# EasyEDA schematic SCH_AidF-Car-Radio.json

## Sheets
1 Power Inlet: TITLE: AidF Radio Power and Connectors; REV: 1.0; Date: 2024-07-25; Sheet: 1/10; Drawn By: Aidan C Franits; Company: AidF Electronics
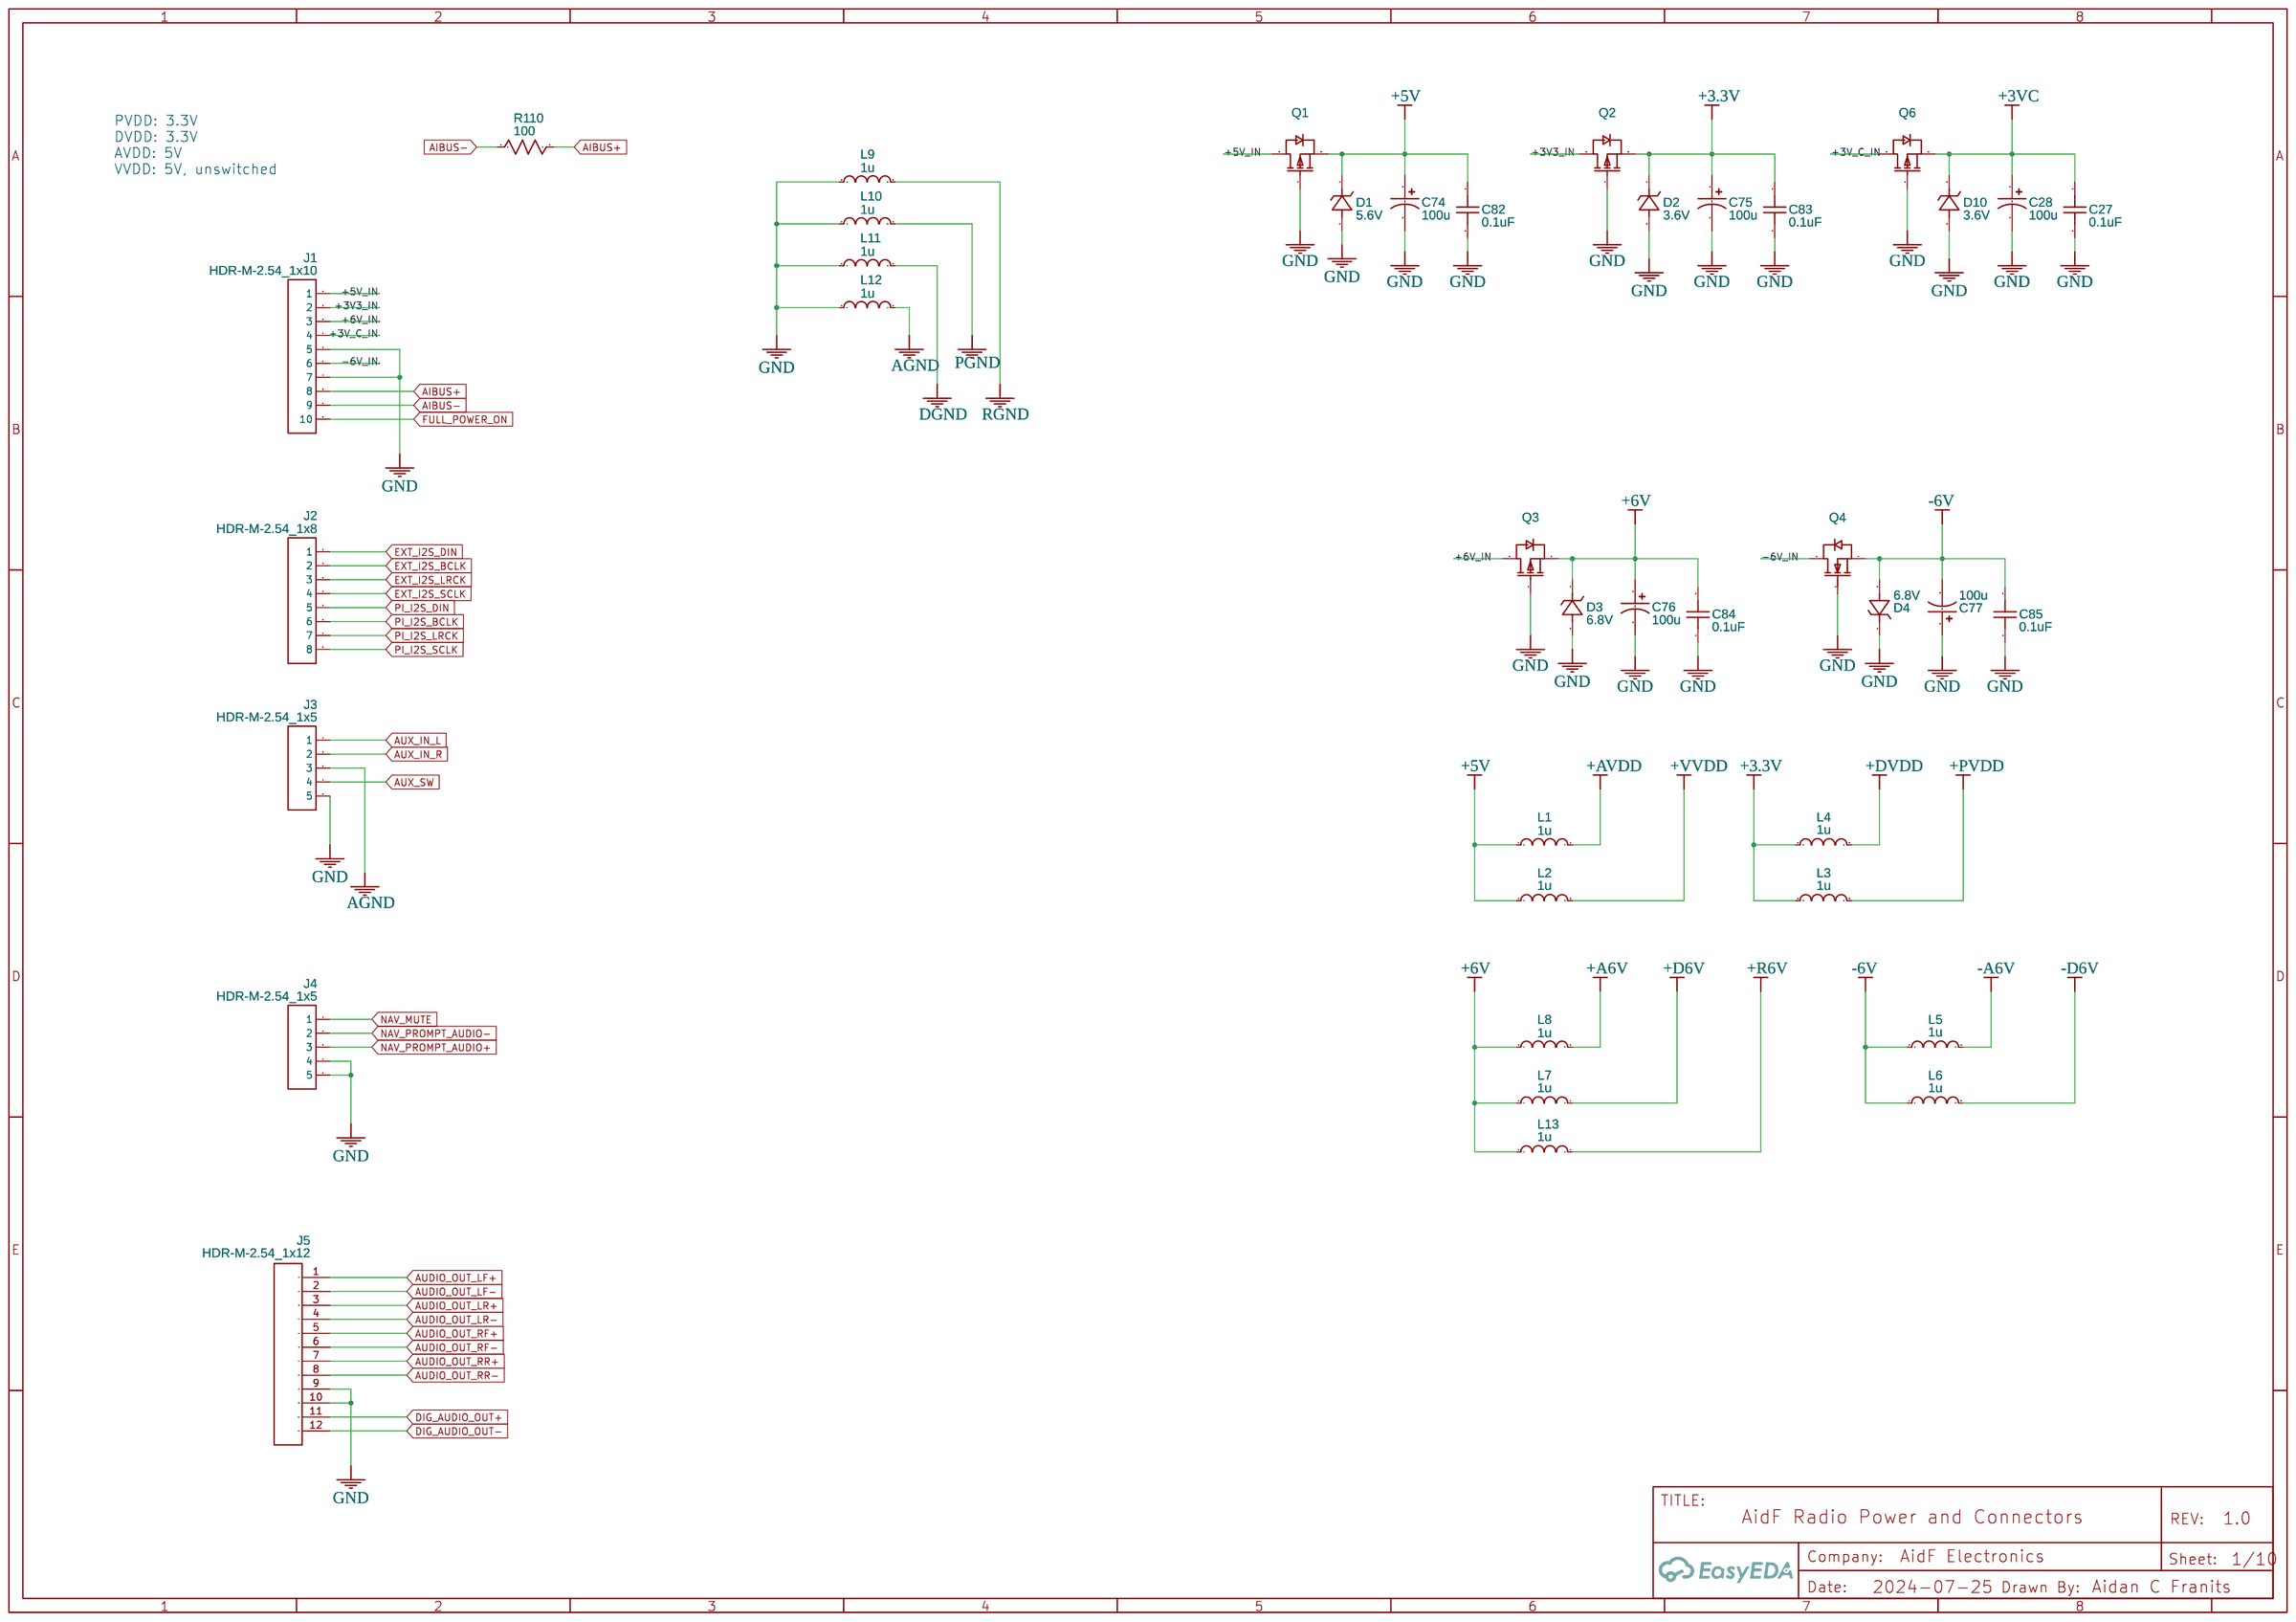
[diagram p0: Power Inlet]
2 Main Controller: TITLE: AidF Radio Main Controller; Sheet: 2/10
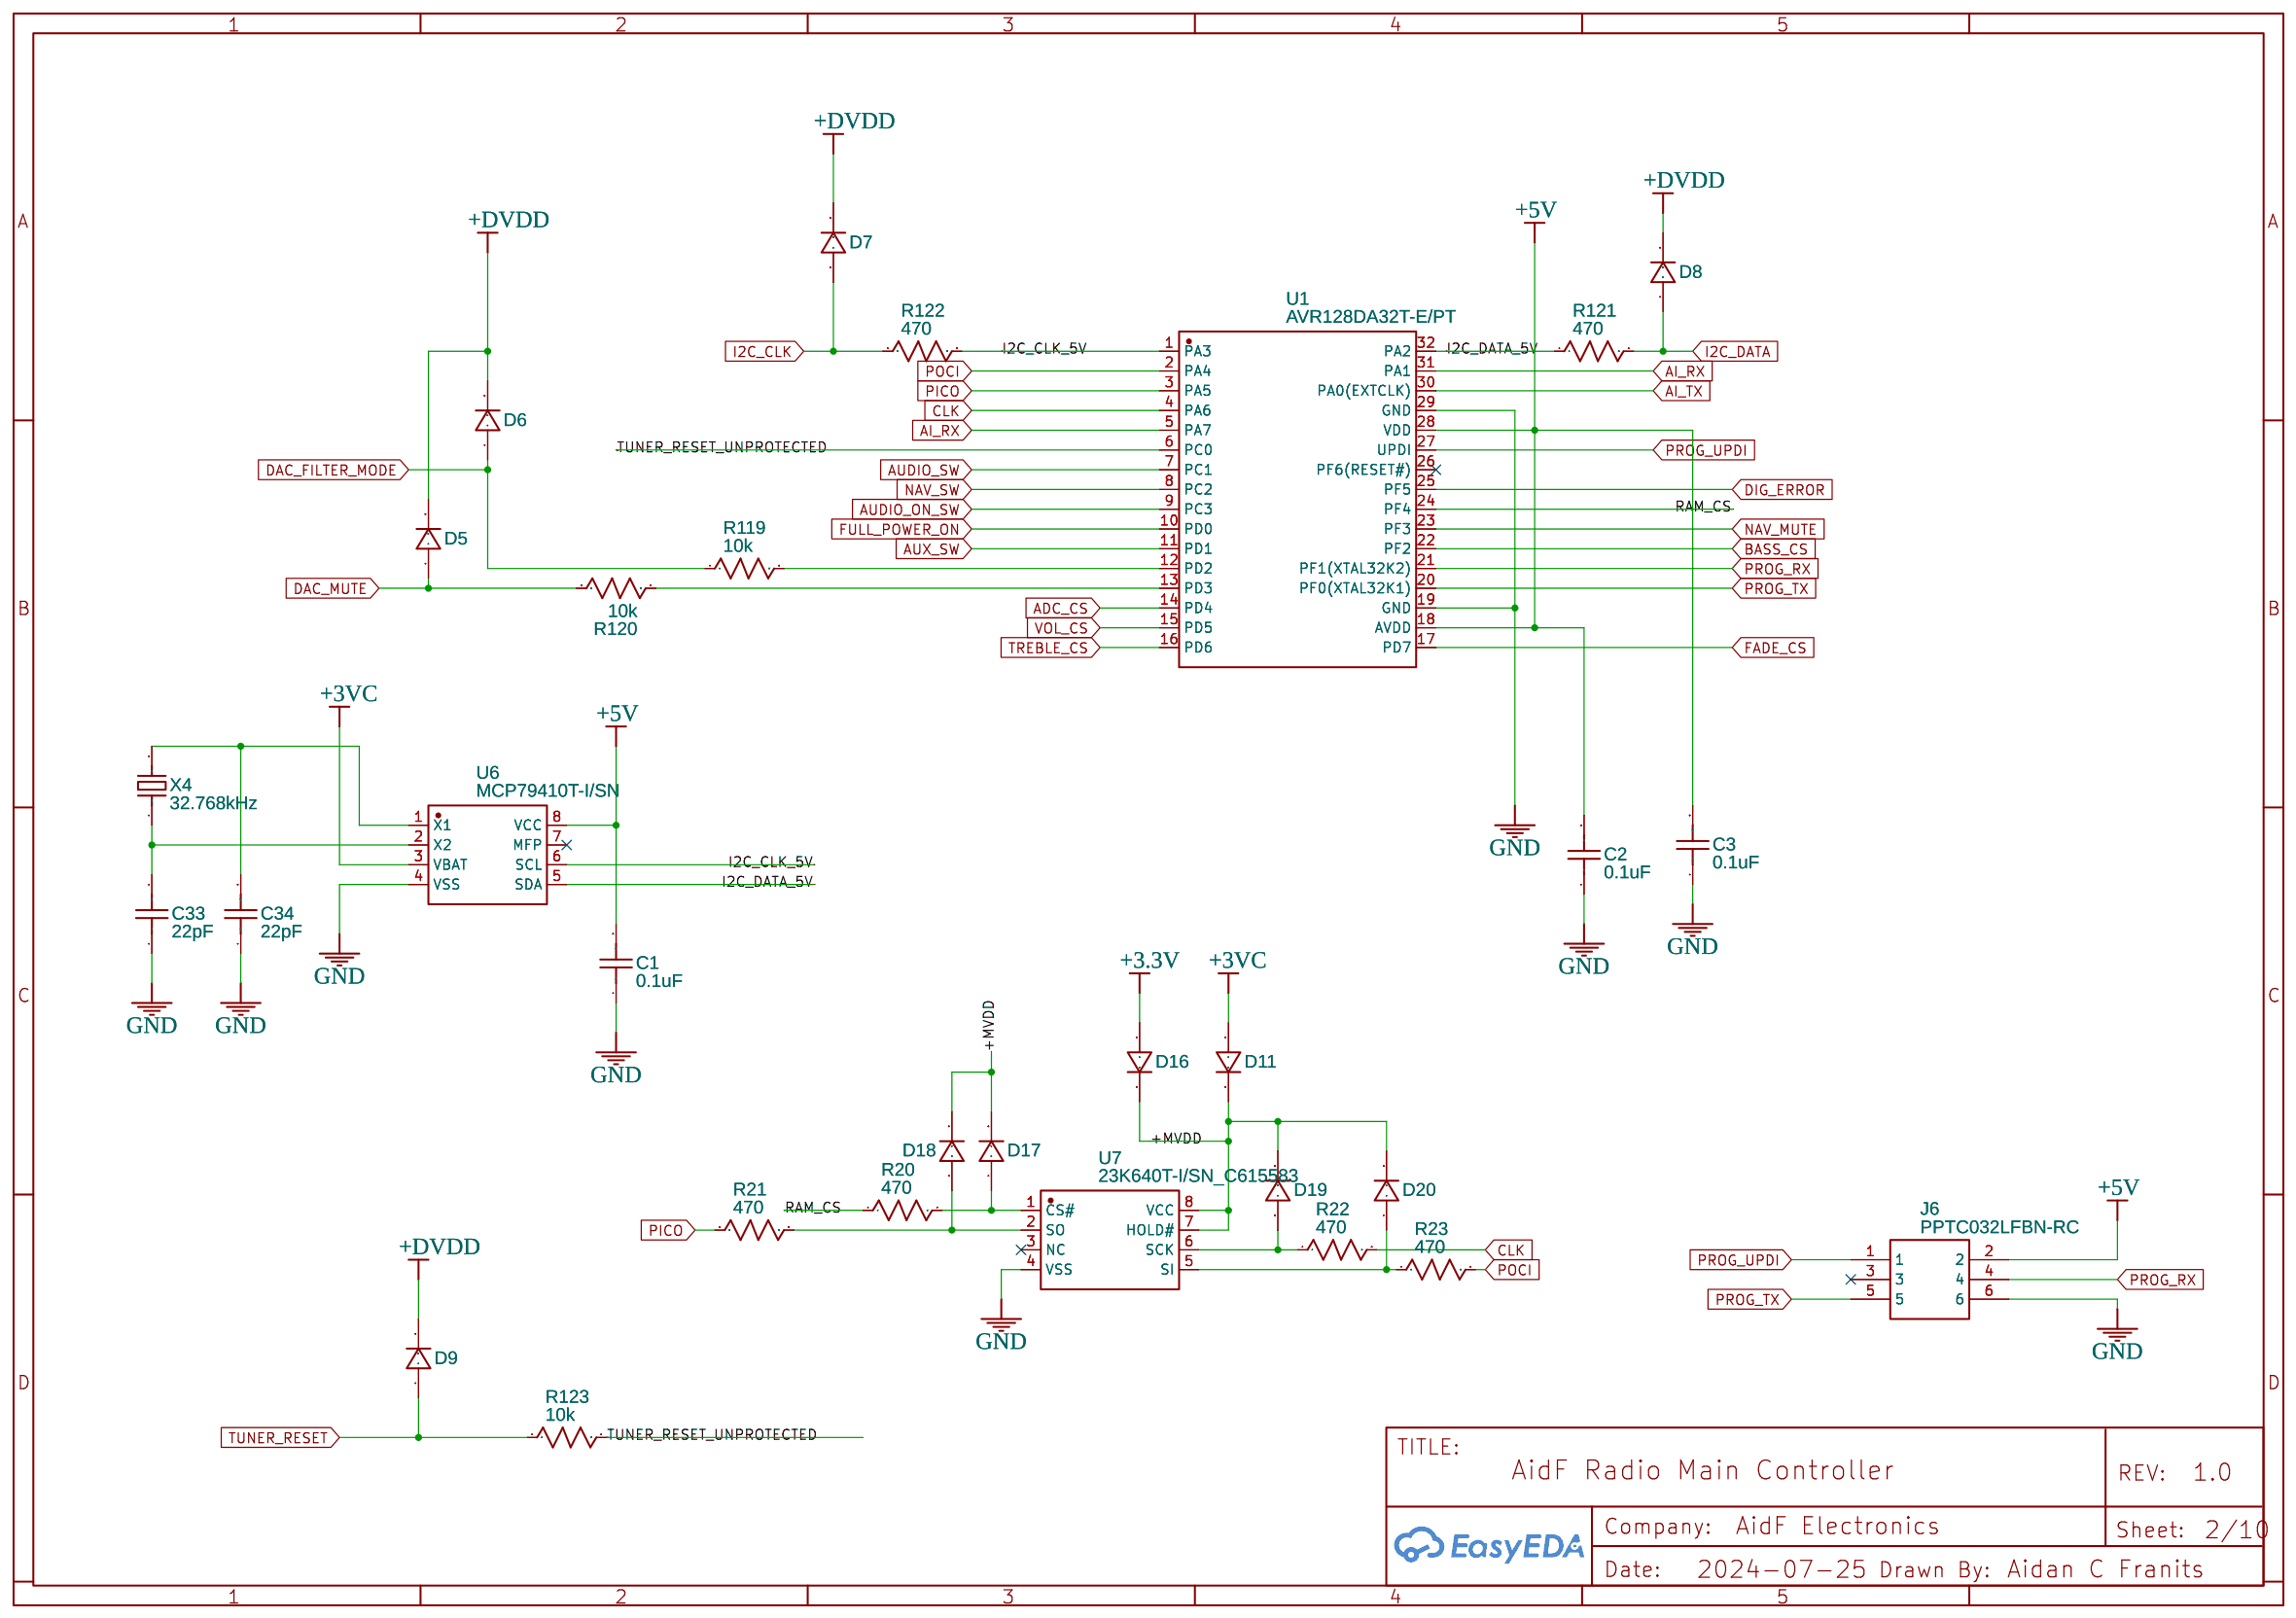
[diagram p1: Main Controller]
3 AIBus Inlet: TITLE: AidF Radio AIBus Transceiver; Date: 2024-09-01; Sheet: 3/10
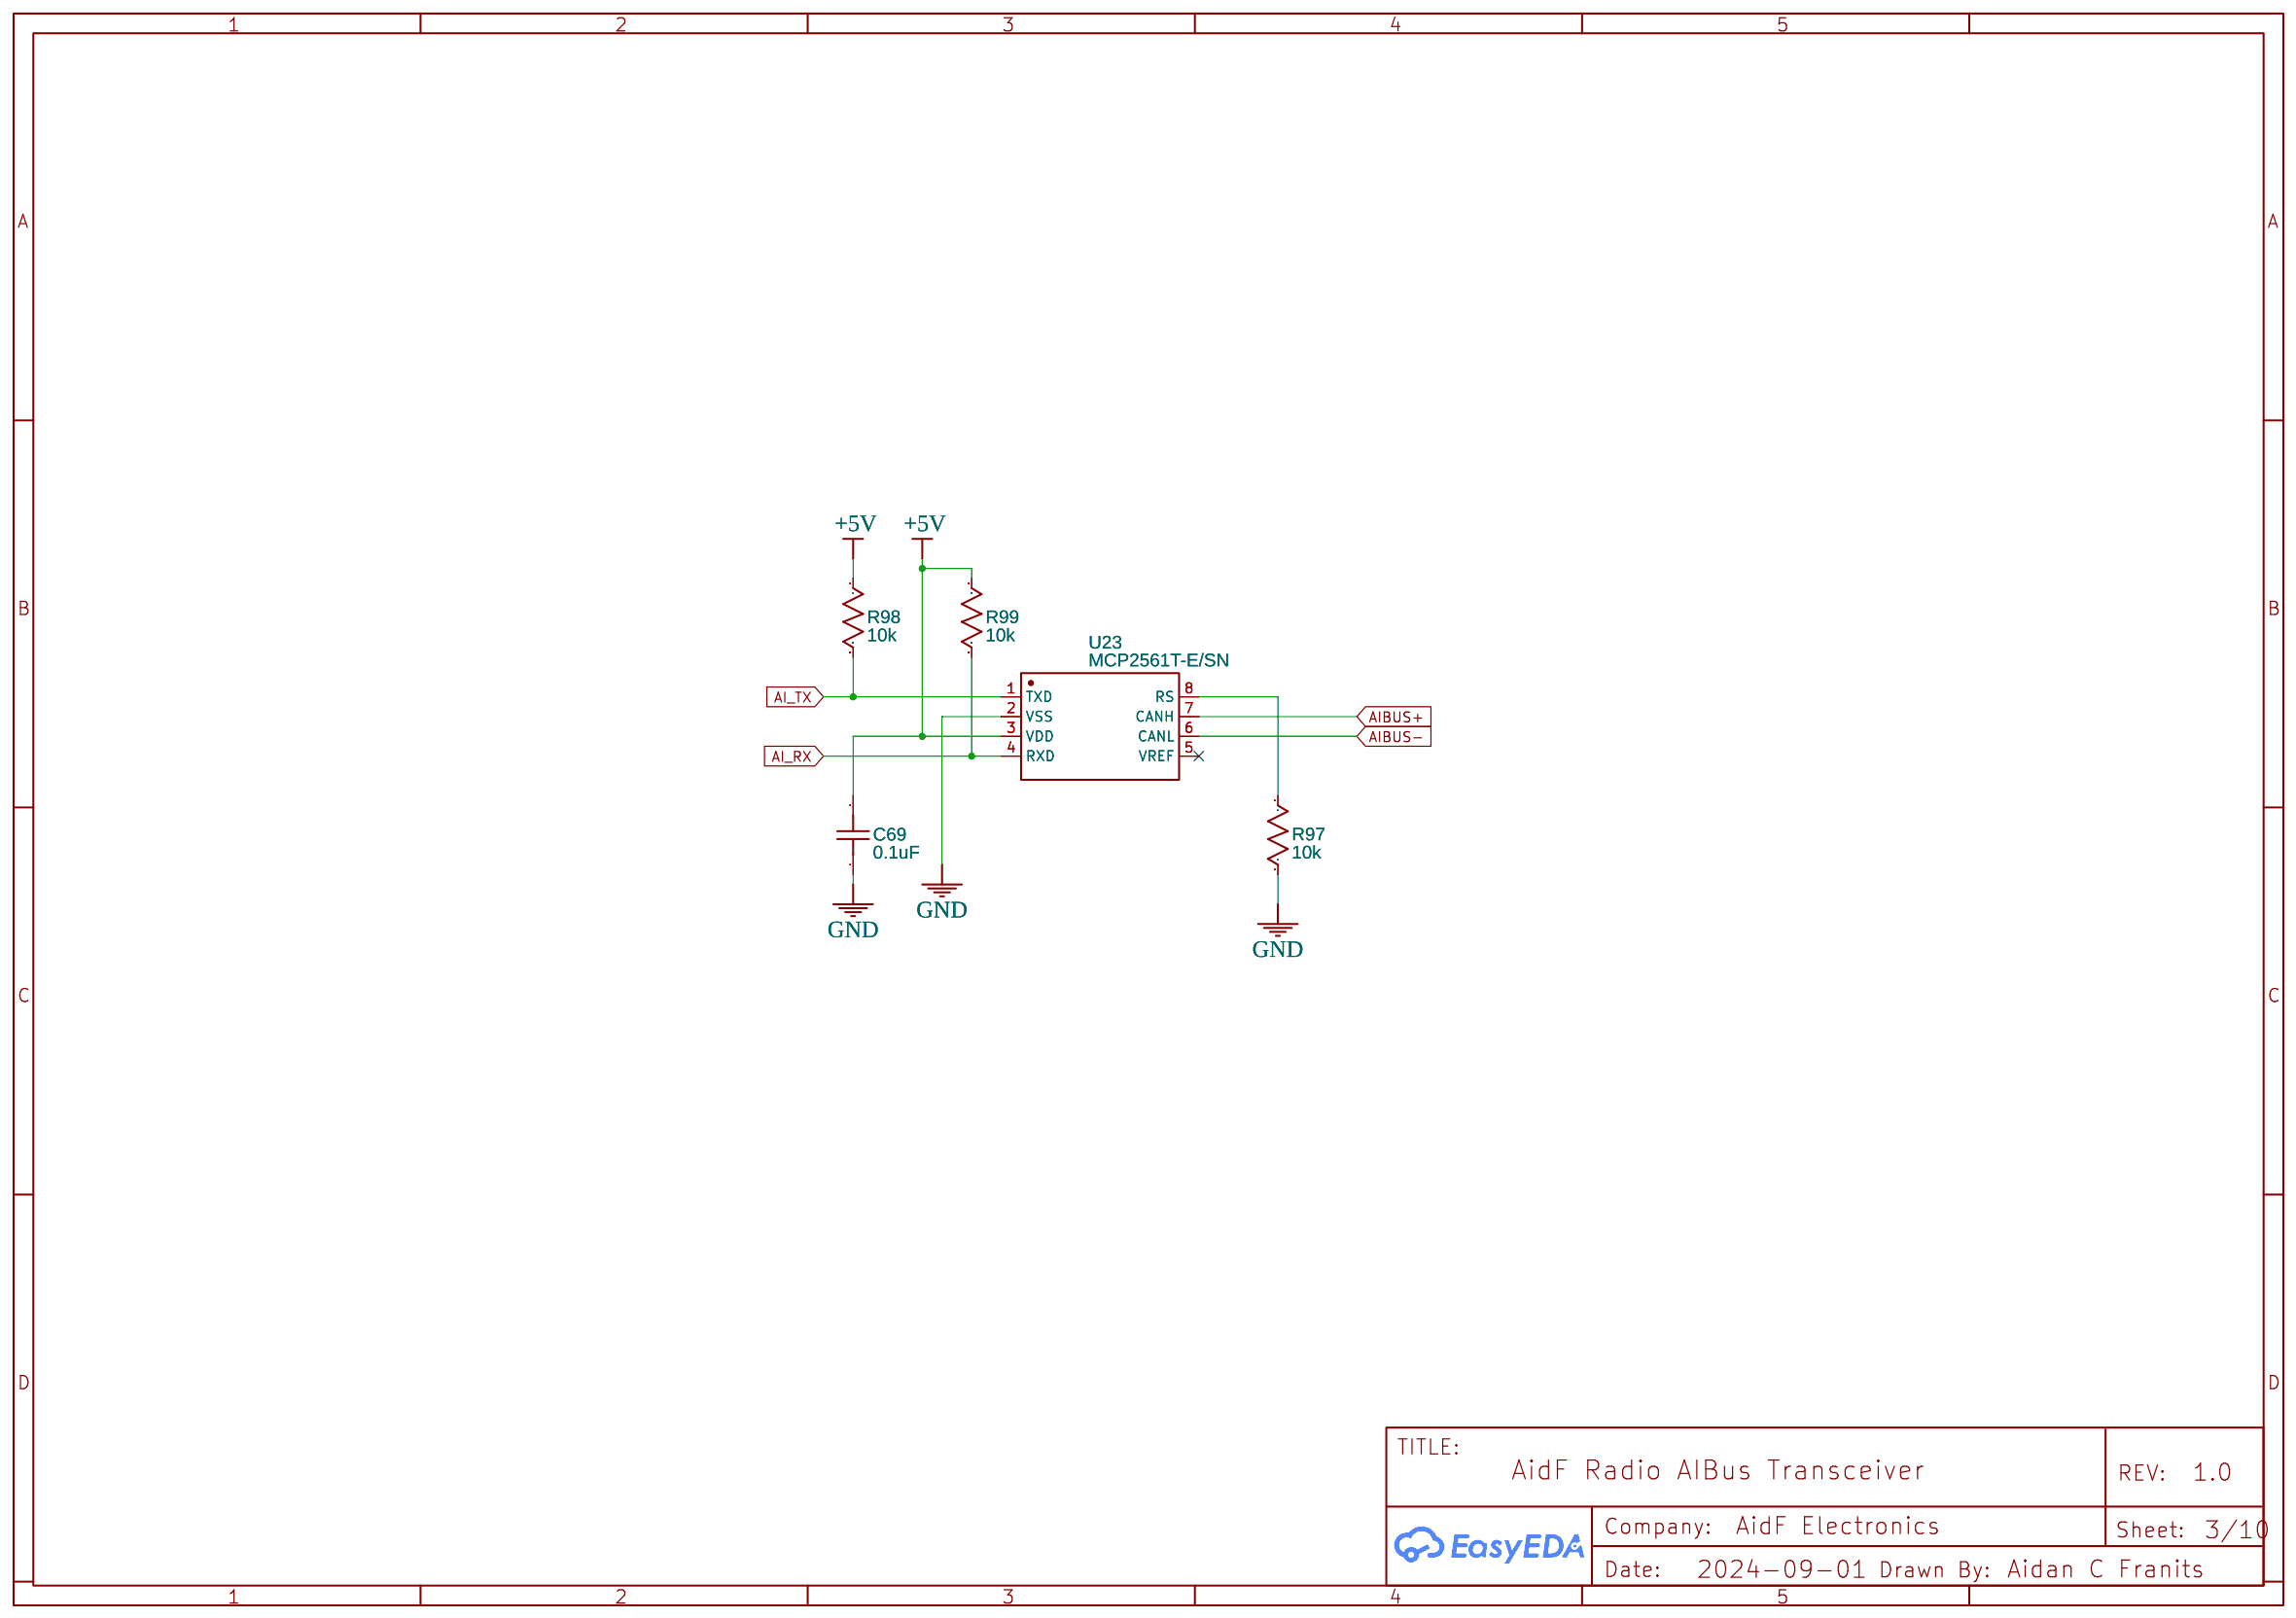
[diagram p2: AIBus Inlet]
4 Antenna Amplifier: TITLE: AidF Radio Antenna Amplifier; Date: 2024-09-04; Sheet: 4/10
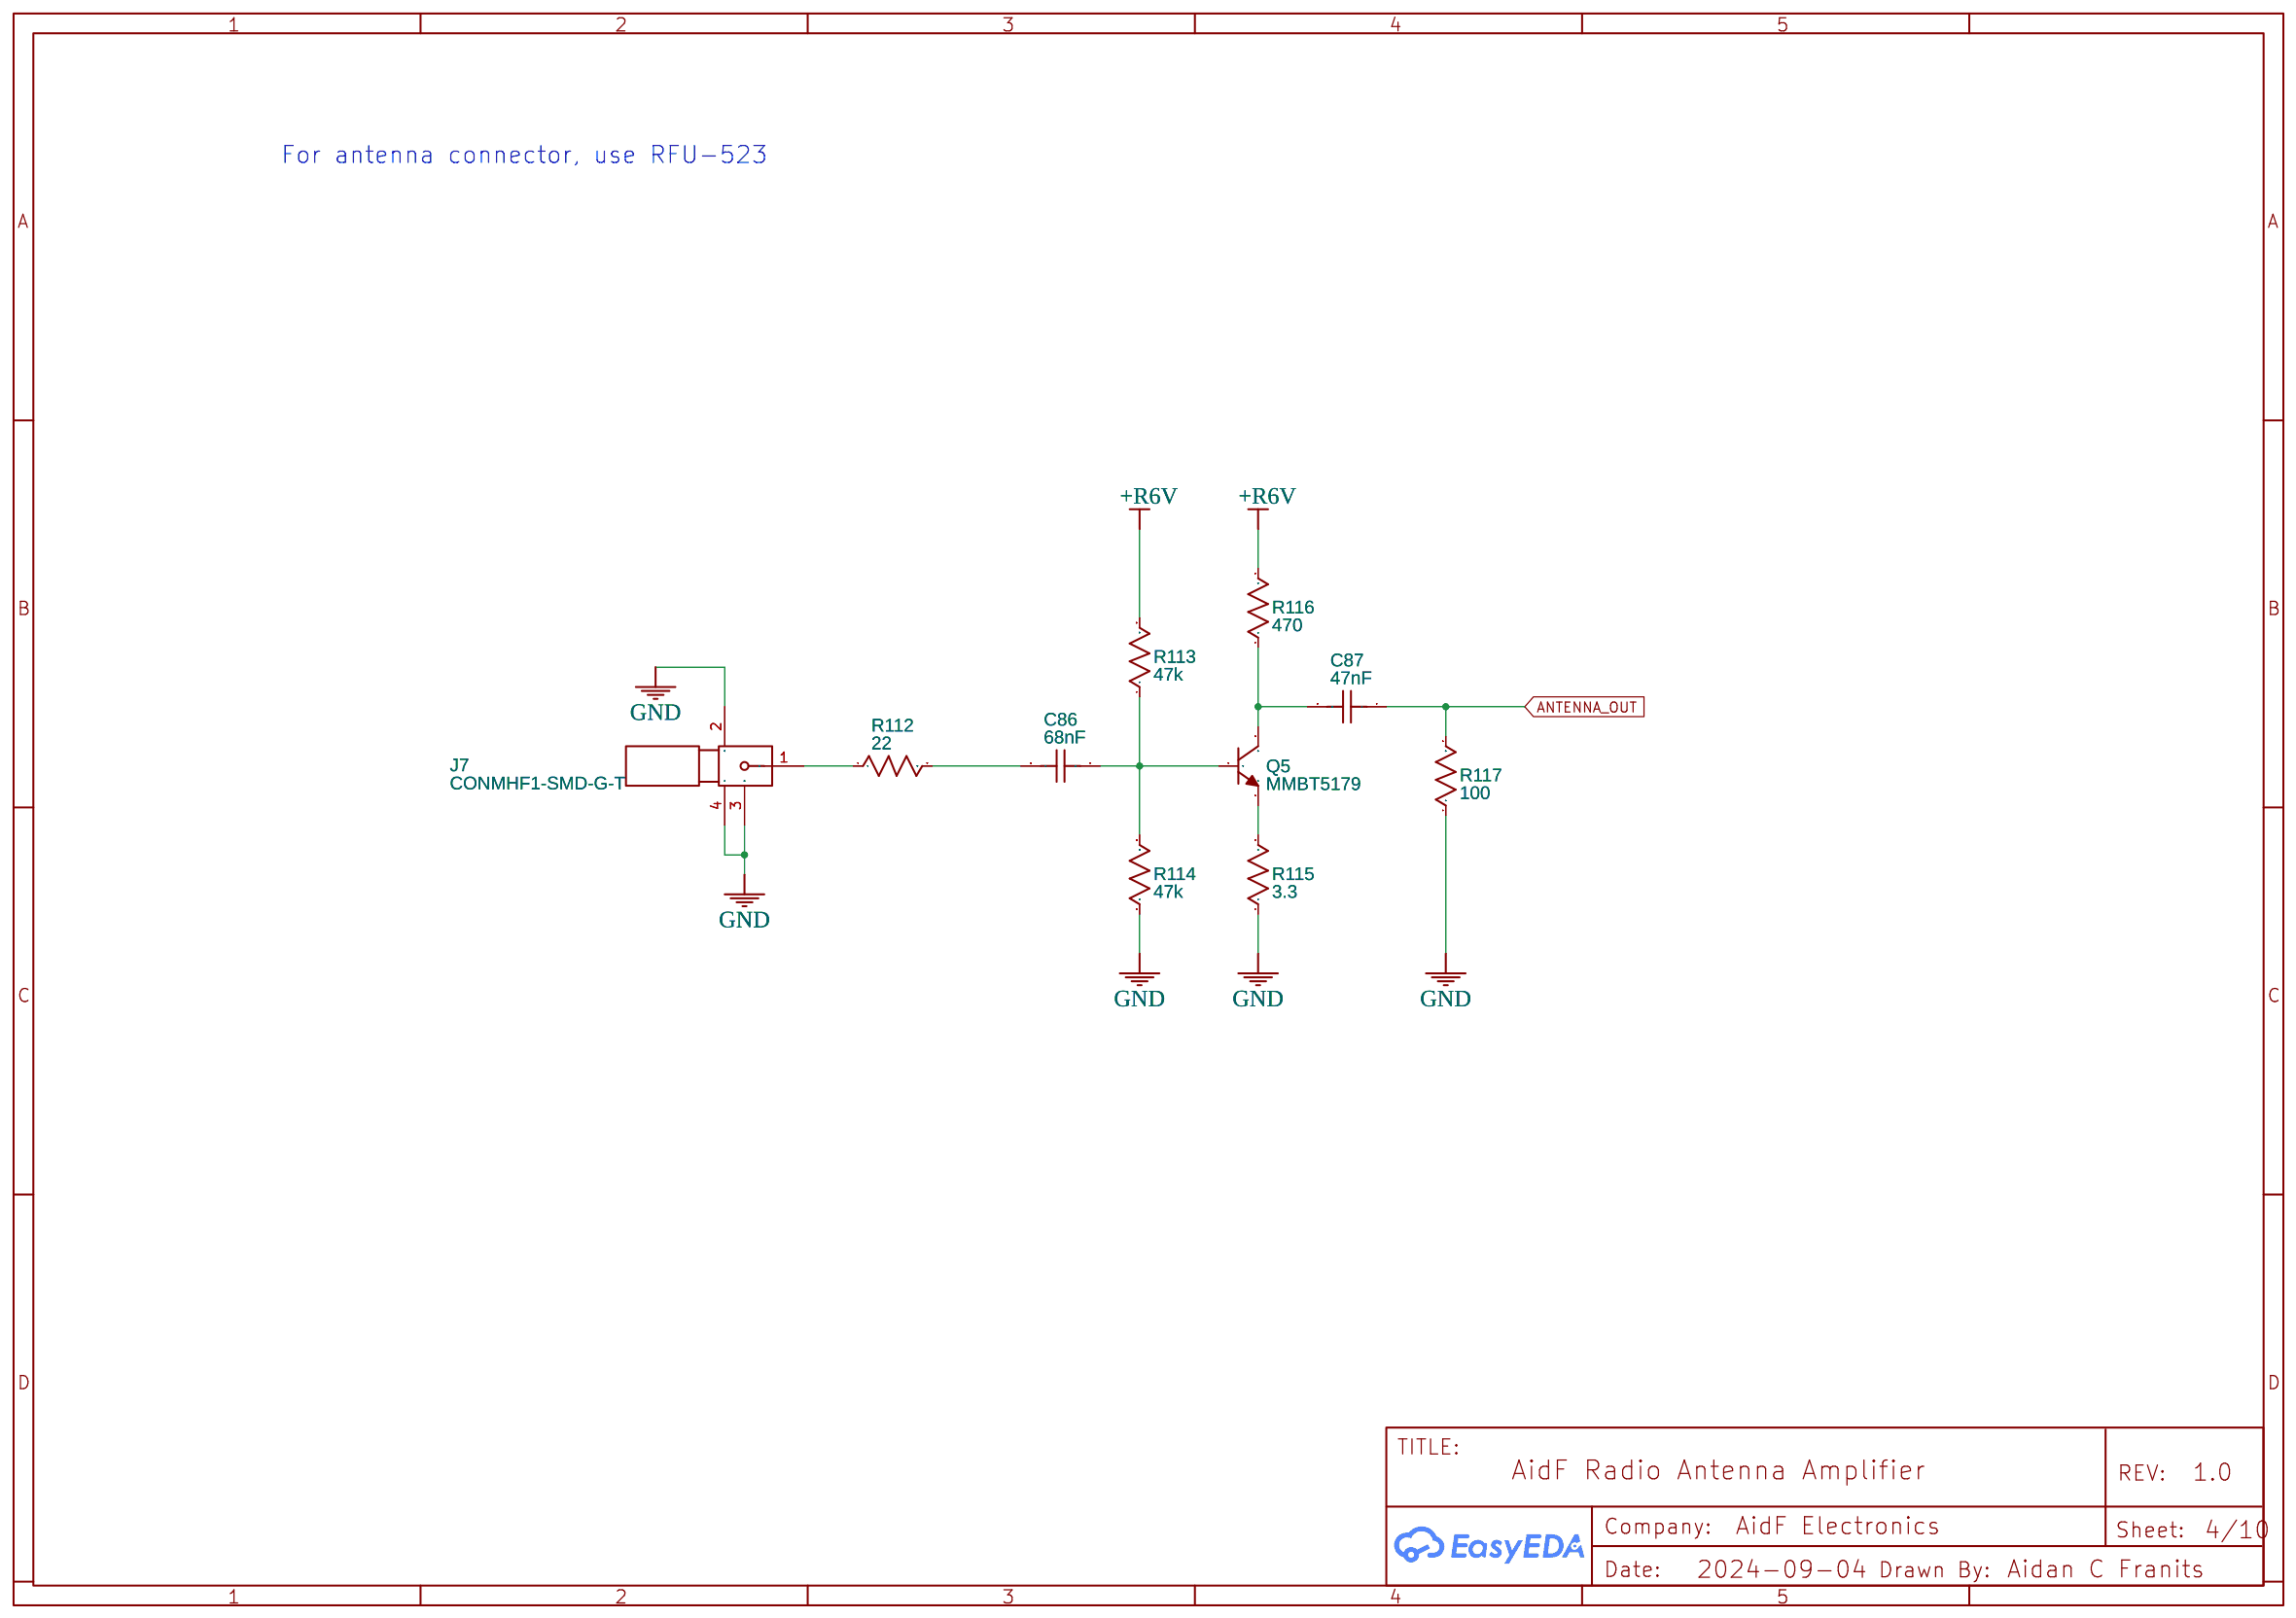
[diagram p3: Antenna Amplifier]
5 Tuner Array: TITLE: AidF Radio Tuner; Date: 2024-07-27; Sheet: 5/10
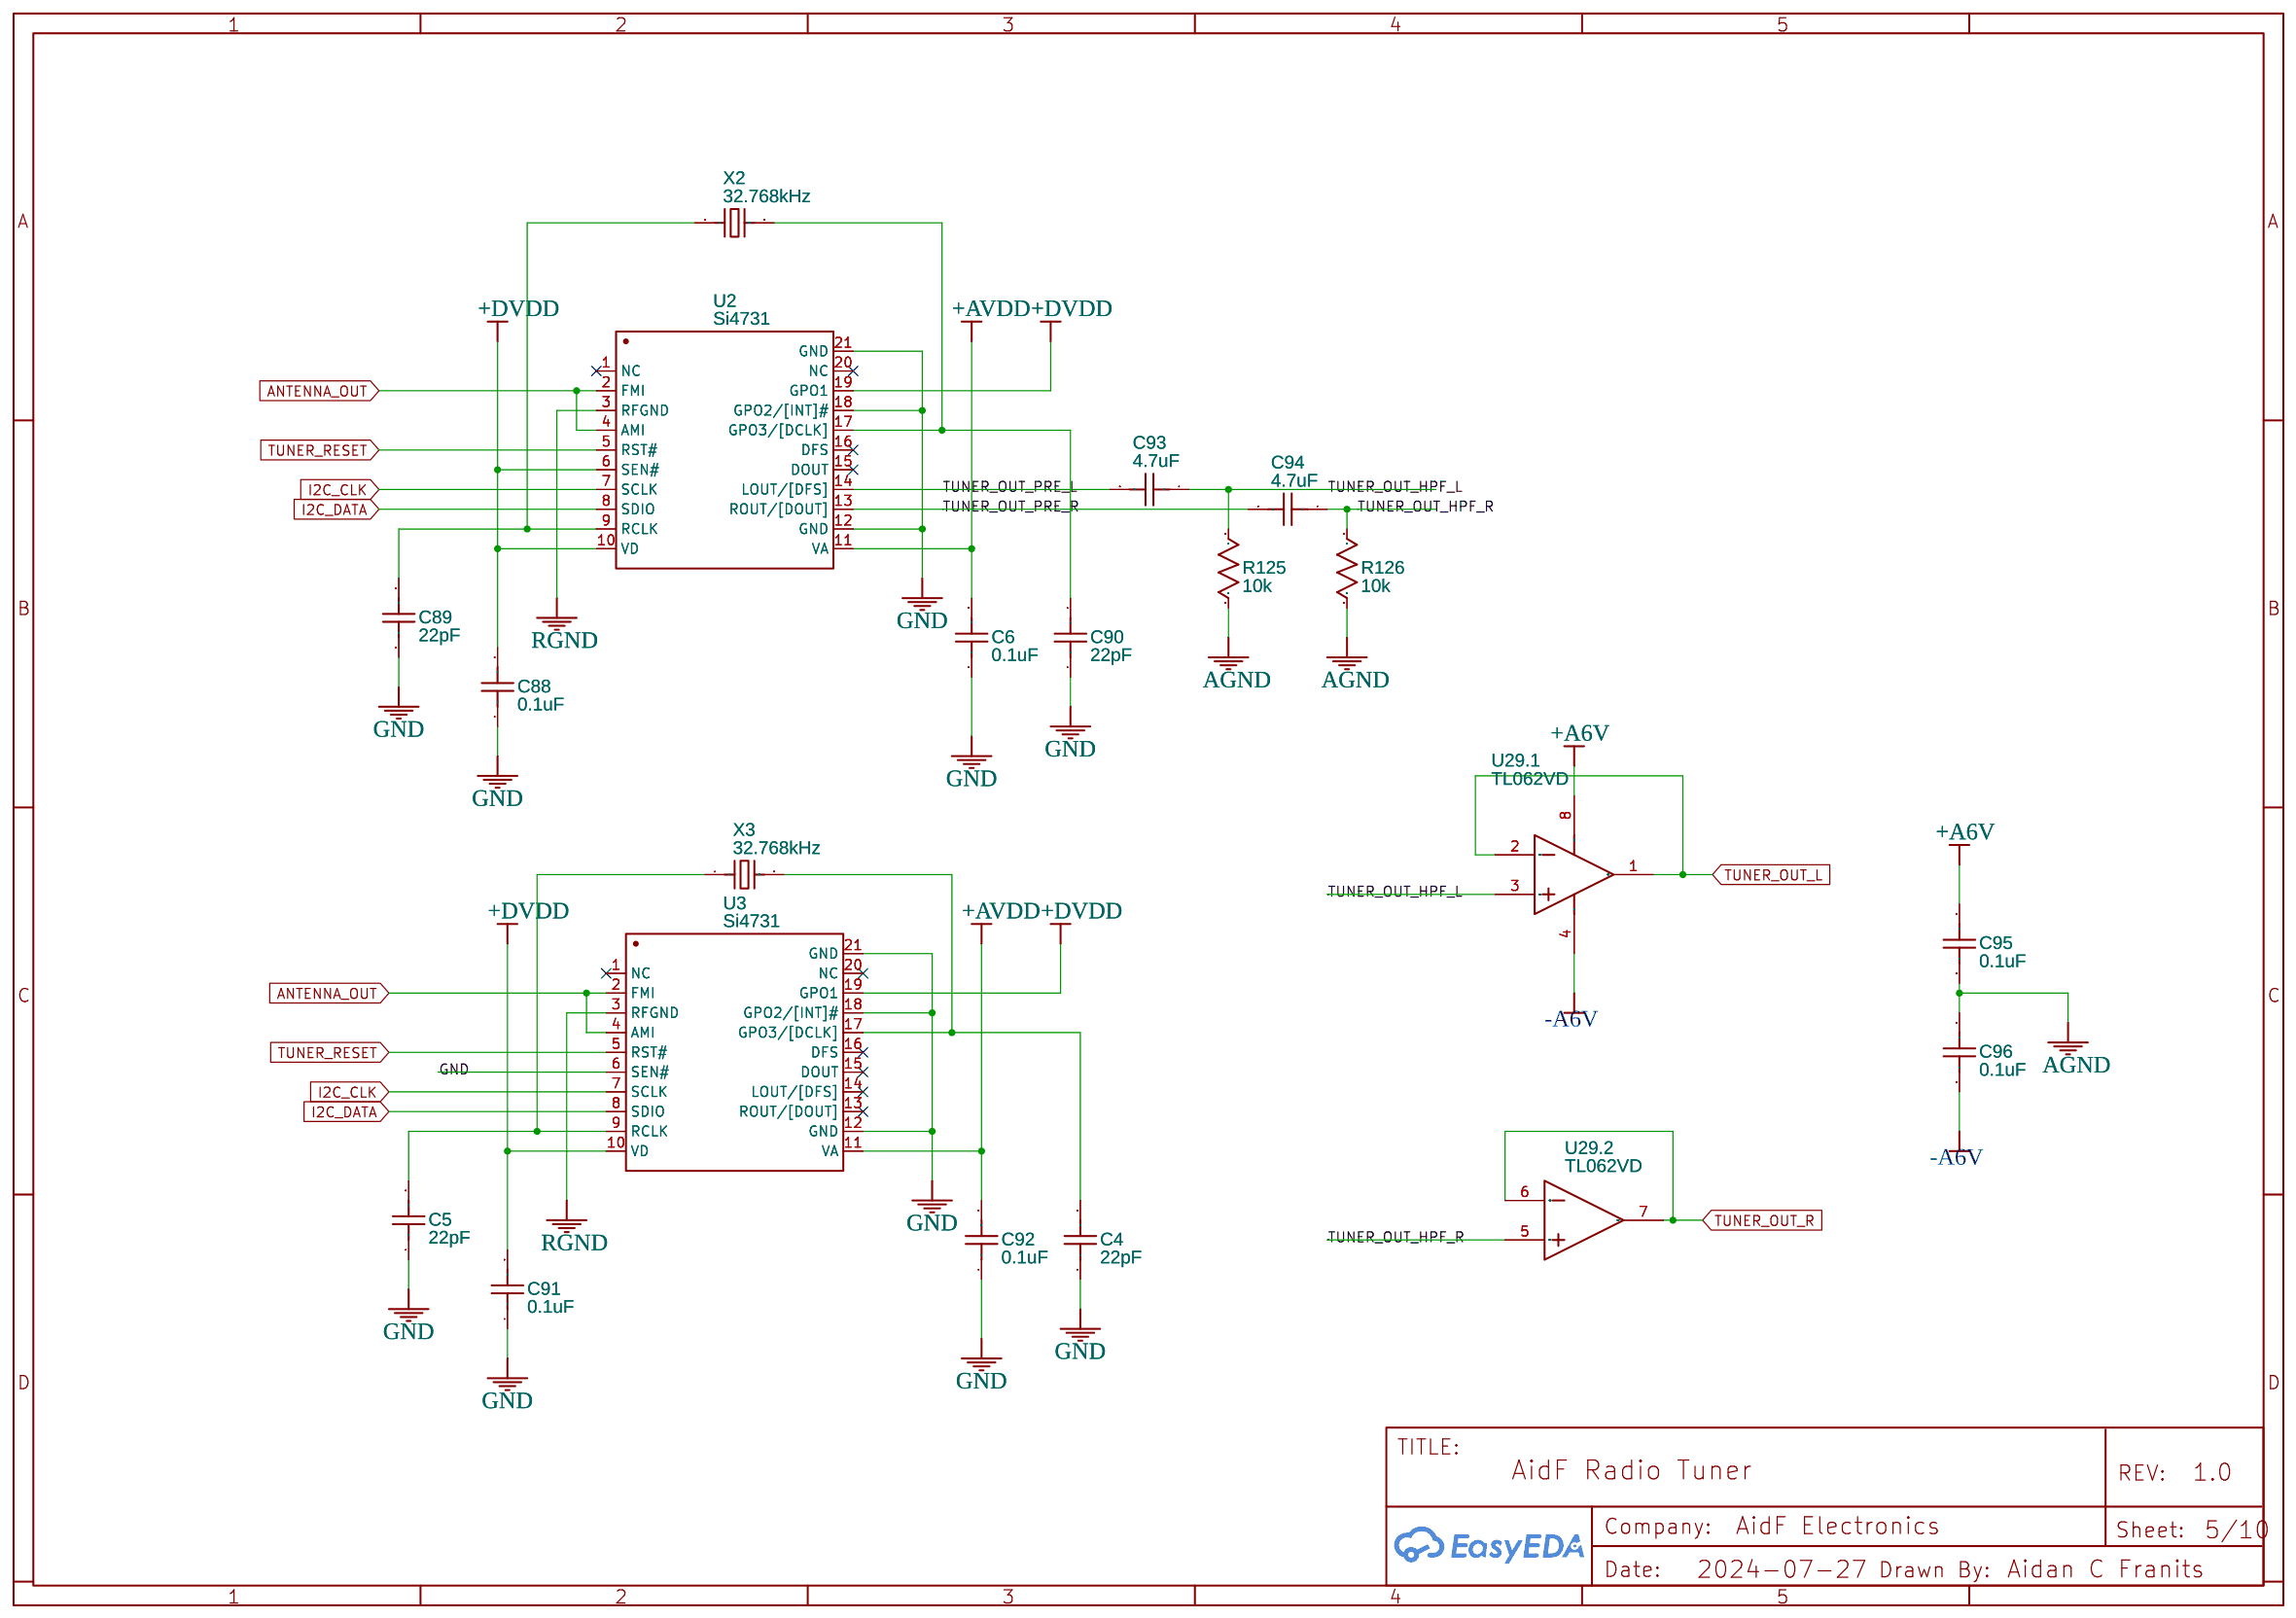
[diagram p4: Tuner Array]
6 Input De-Balancers: TITLE: AidF Radio Input Unbalancer; Date: 2024-09-01; Sheet: 6/10
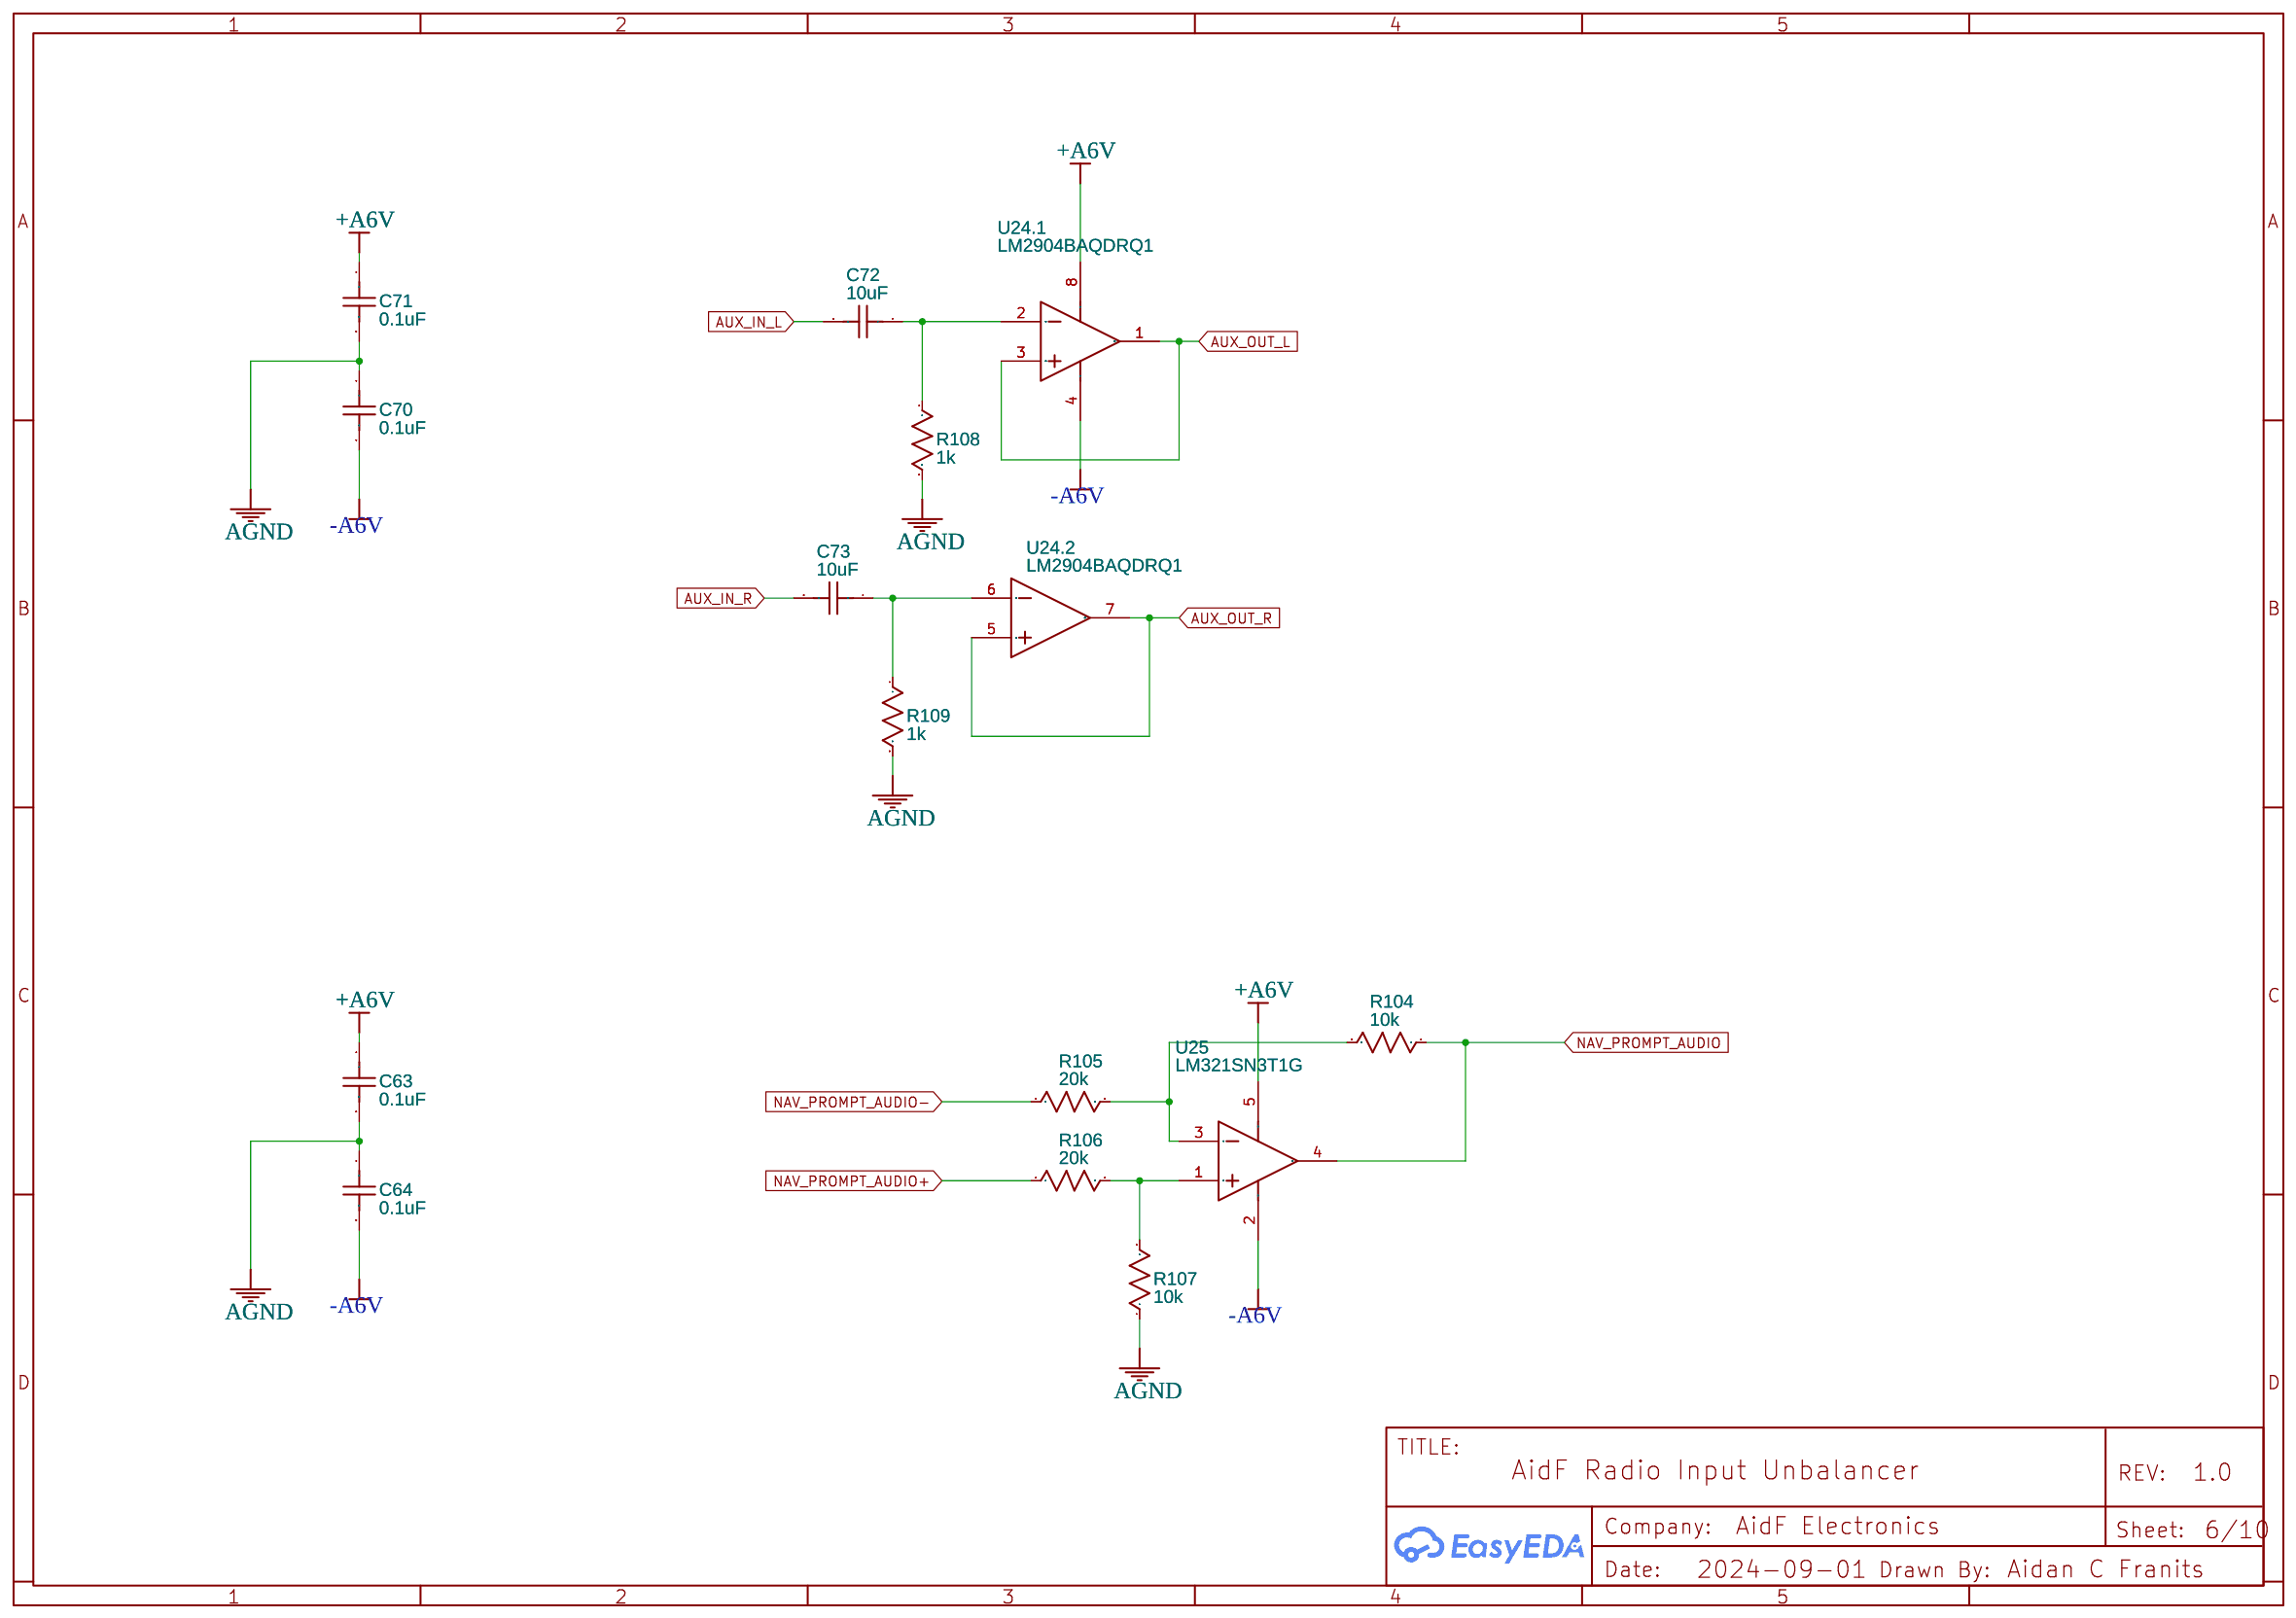
[diagram p5: Input De-Balancers]
7 Audio Switch: TITLE: AidF Radio Audio Switch; Date: 2024-08-17; Sheet: 7/10
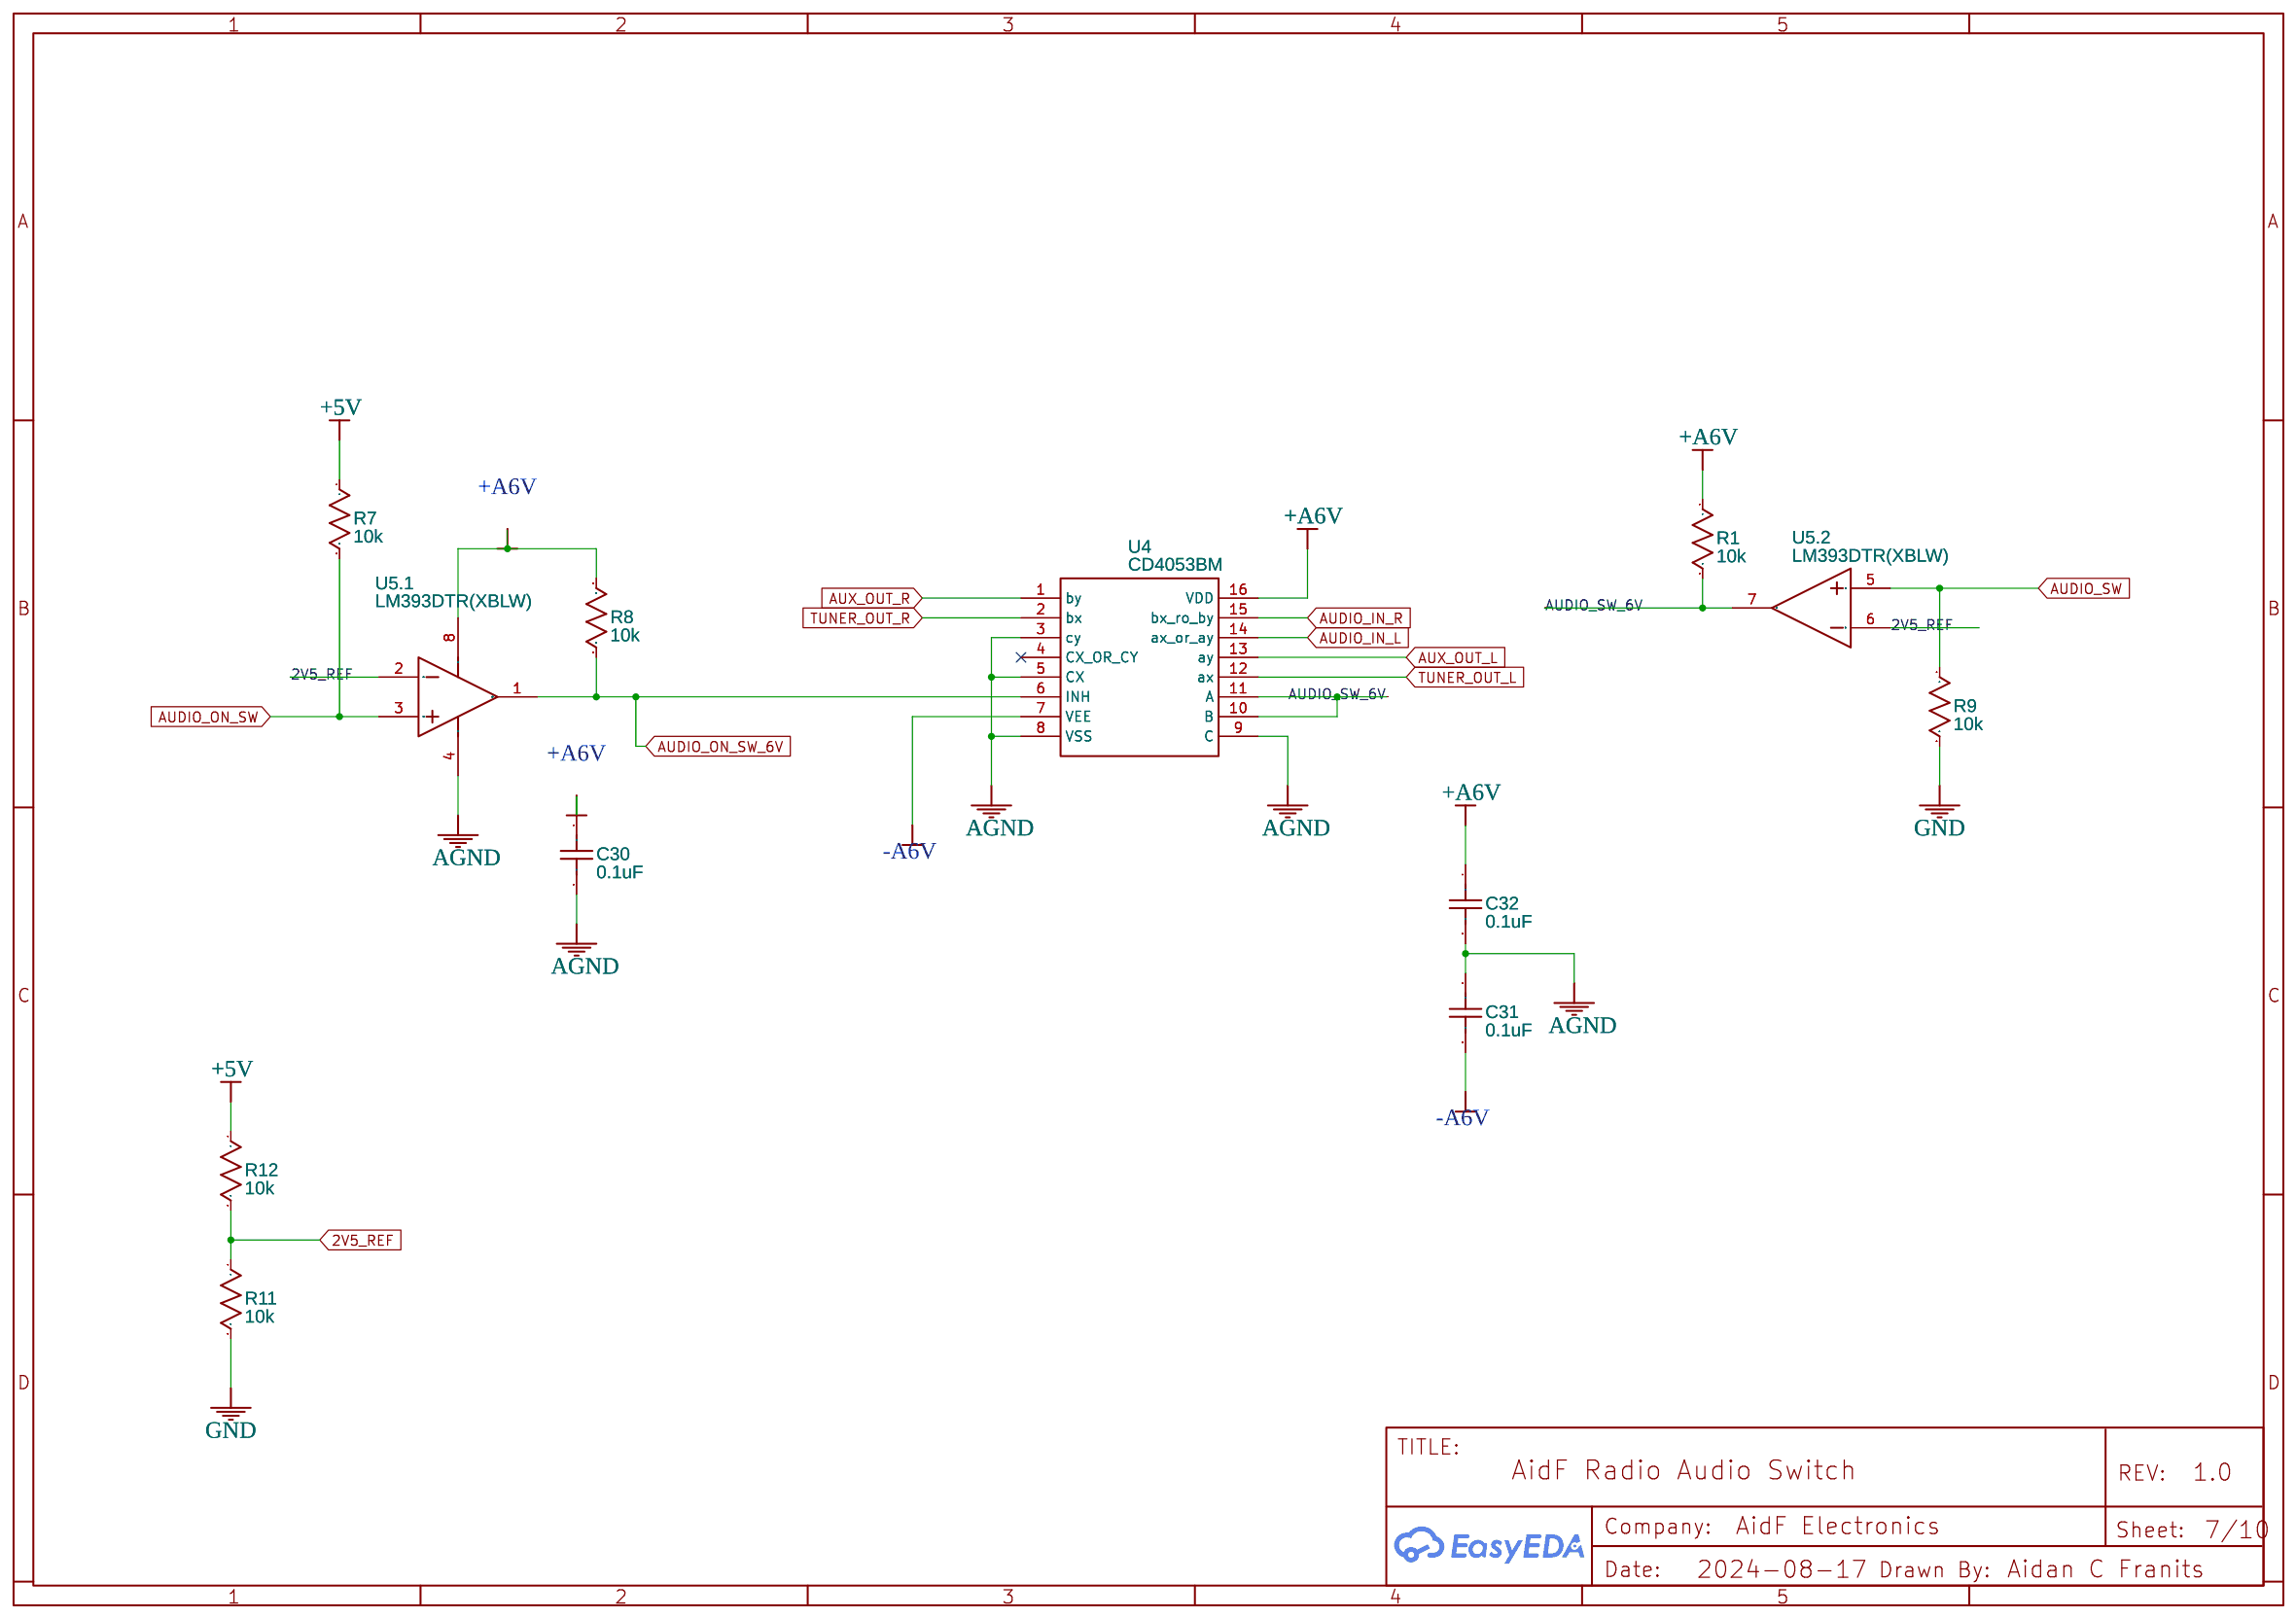
[diagram p6: Audio Switch]
8 Digital Audio Processing: TITLE: AidF Radio ADC; Date: 2024-08-20; Sheet: 8/10
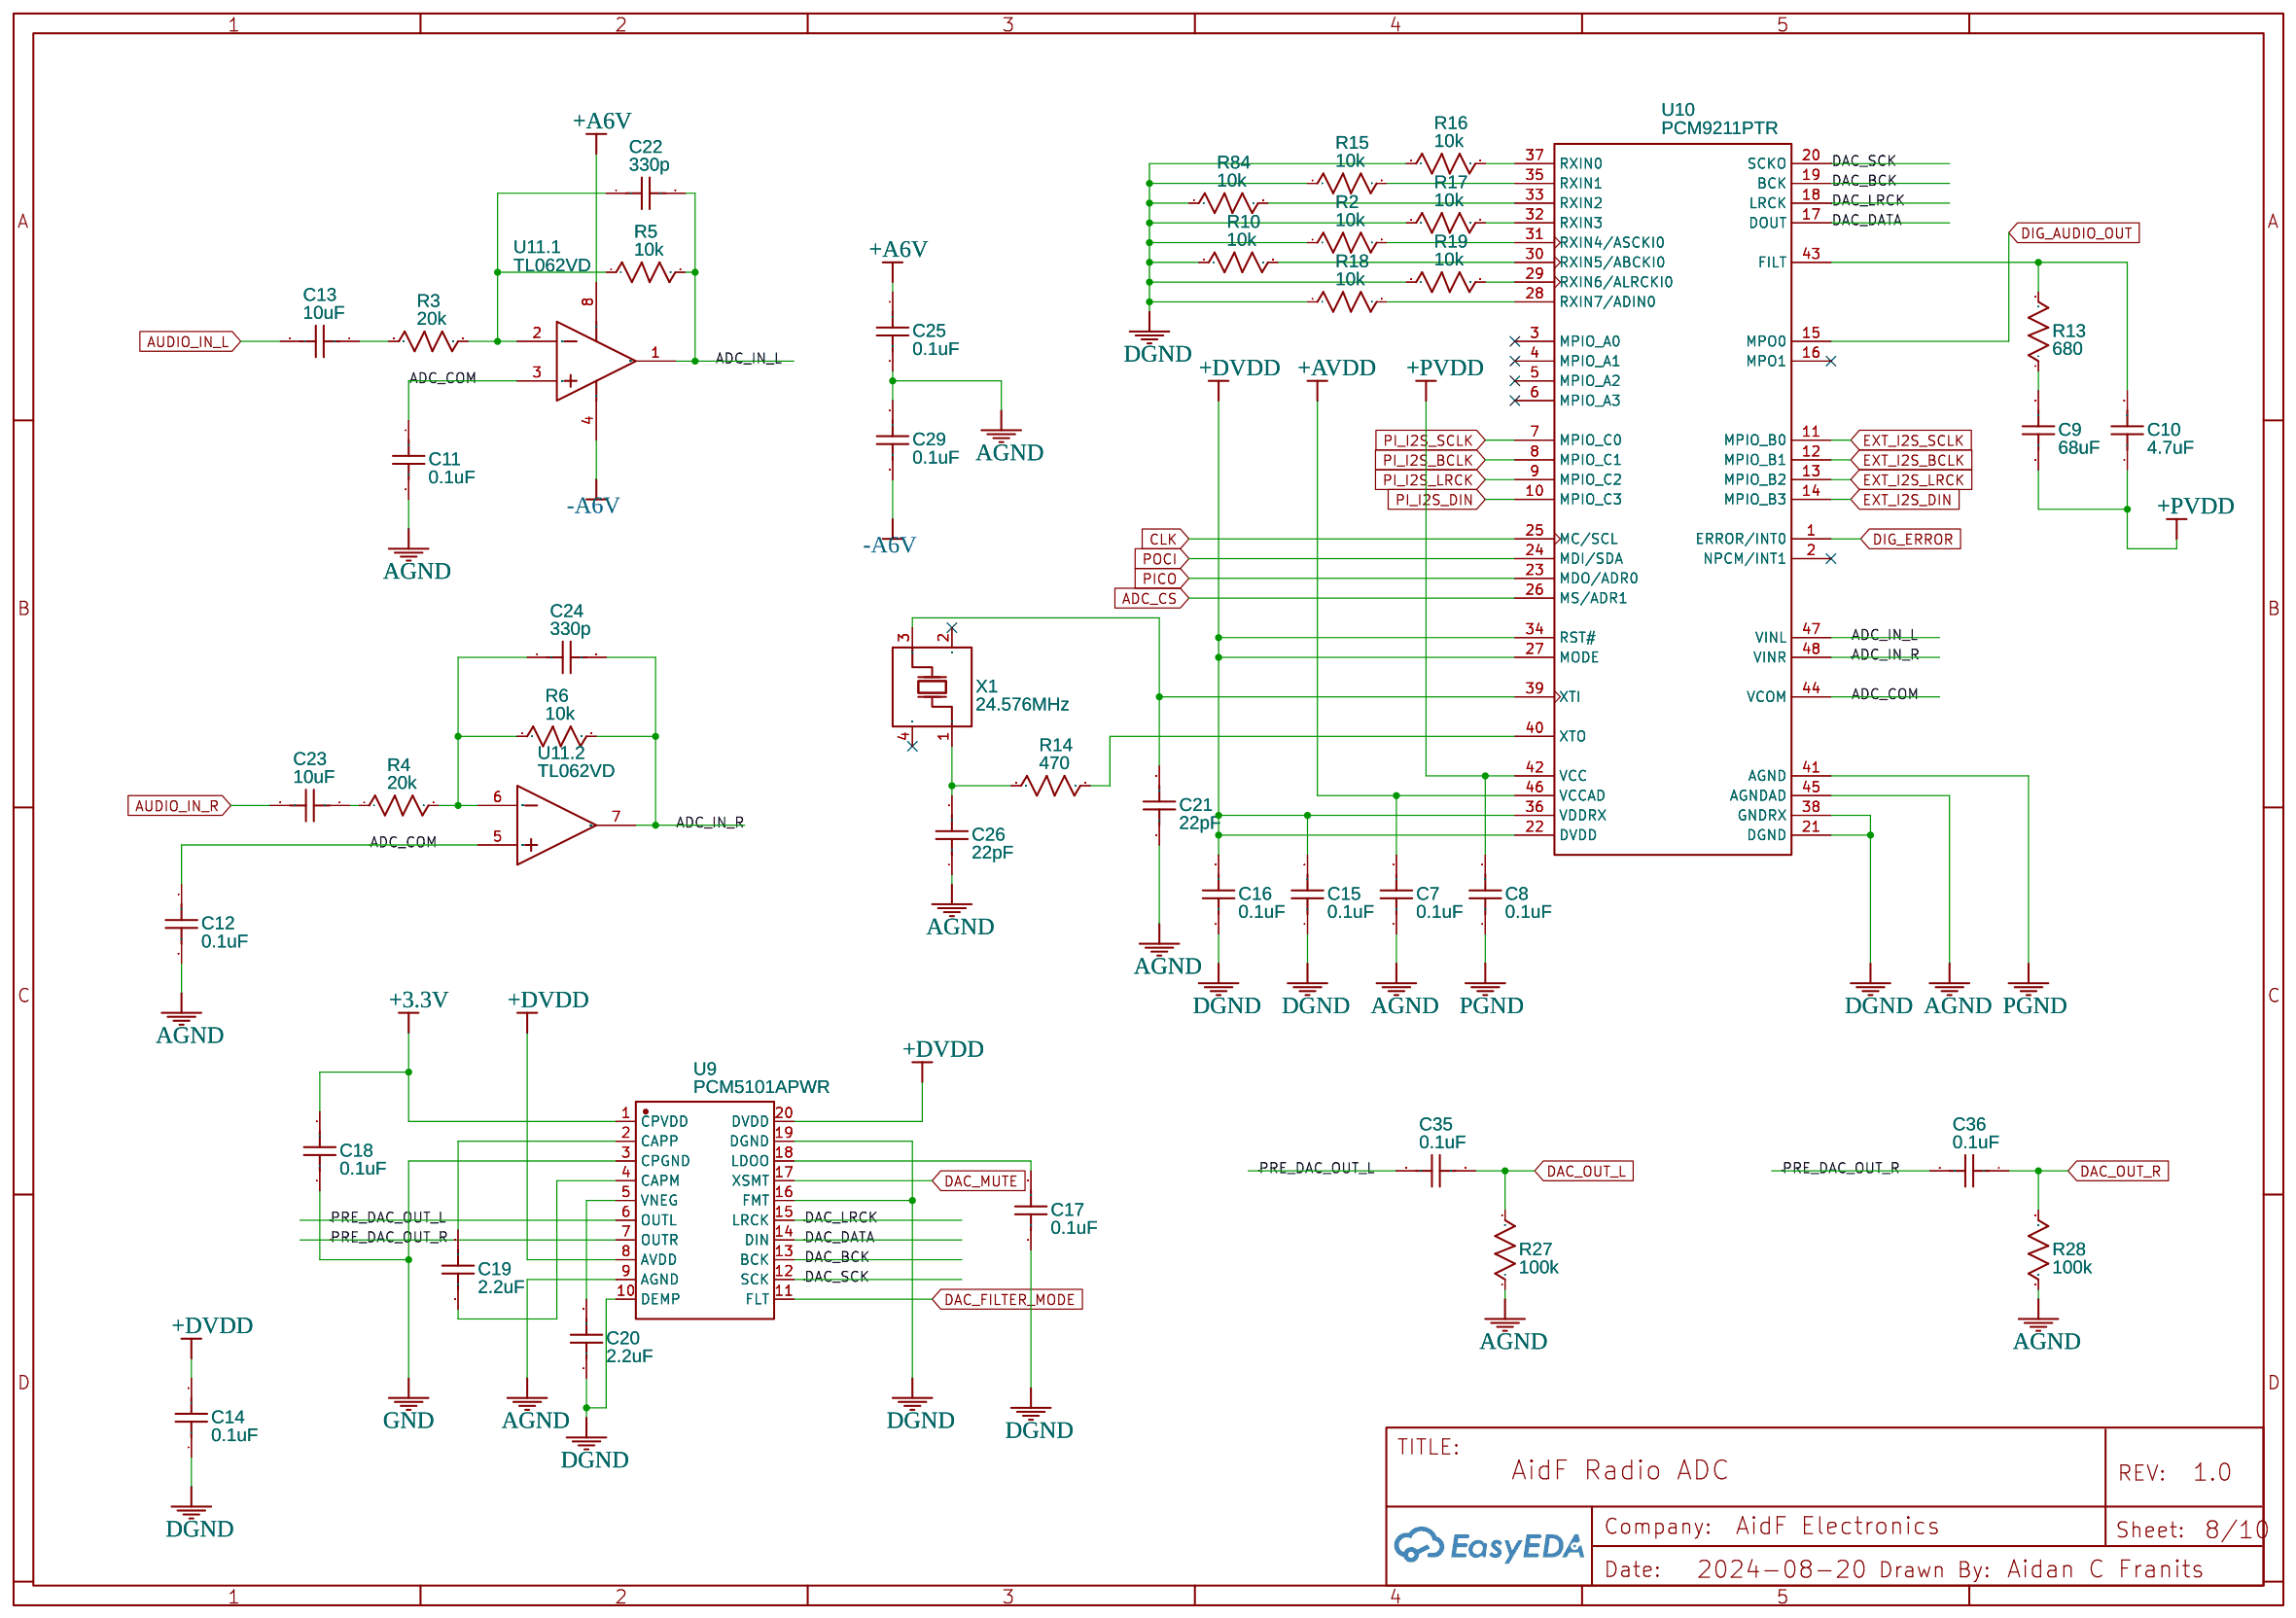
[diagram p7: Digital Audio Processing]
9 Volume and Tone: TITLE: AidF Radio Volume and Tone; Date: 2024-08-29; Sheet: 9/10
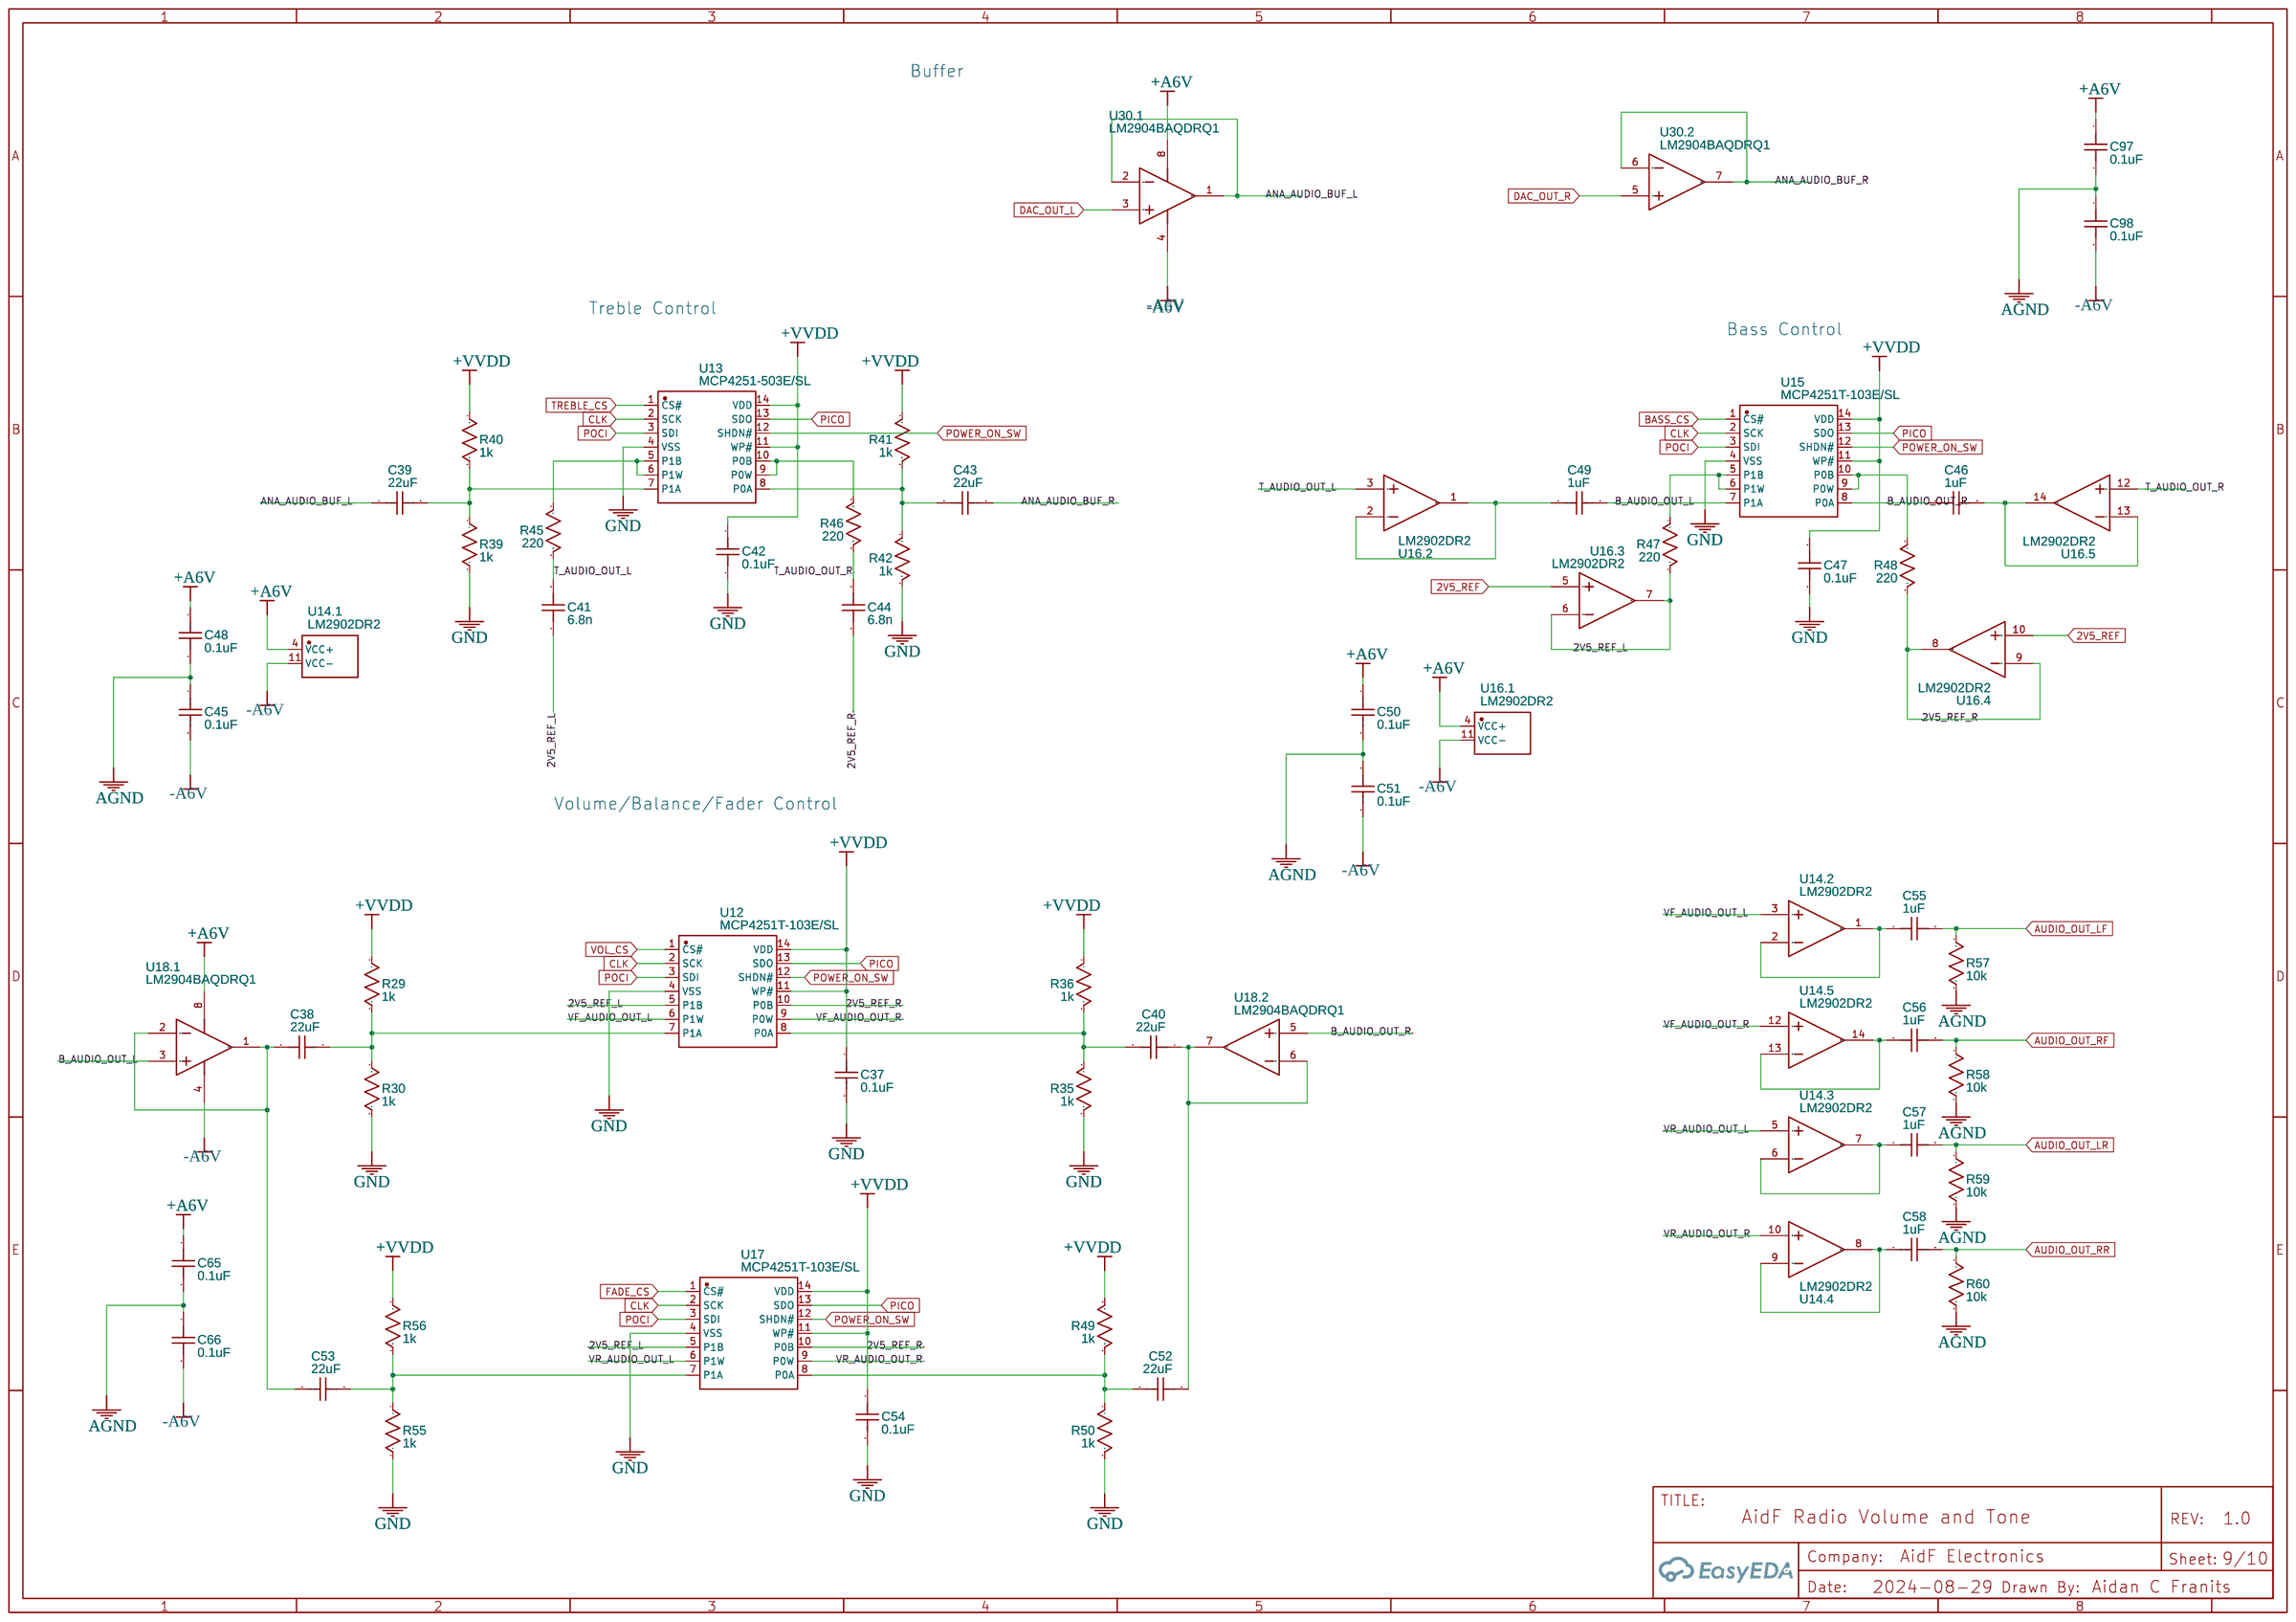
[diagram p8: Volume and Tone]
10 Output Balancers: TITLE: AidF Radio Output Balancers; Date: 2024-08-31; Sheet: 10/10
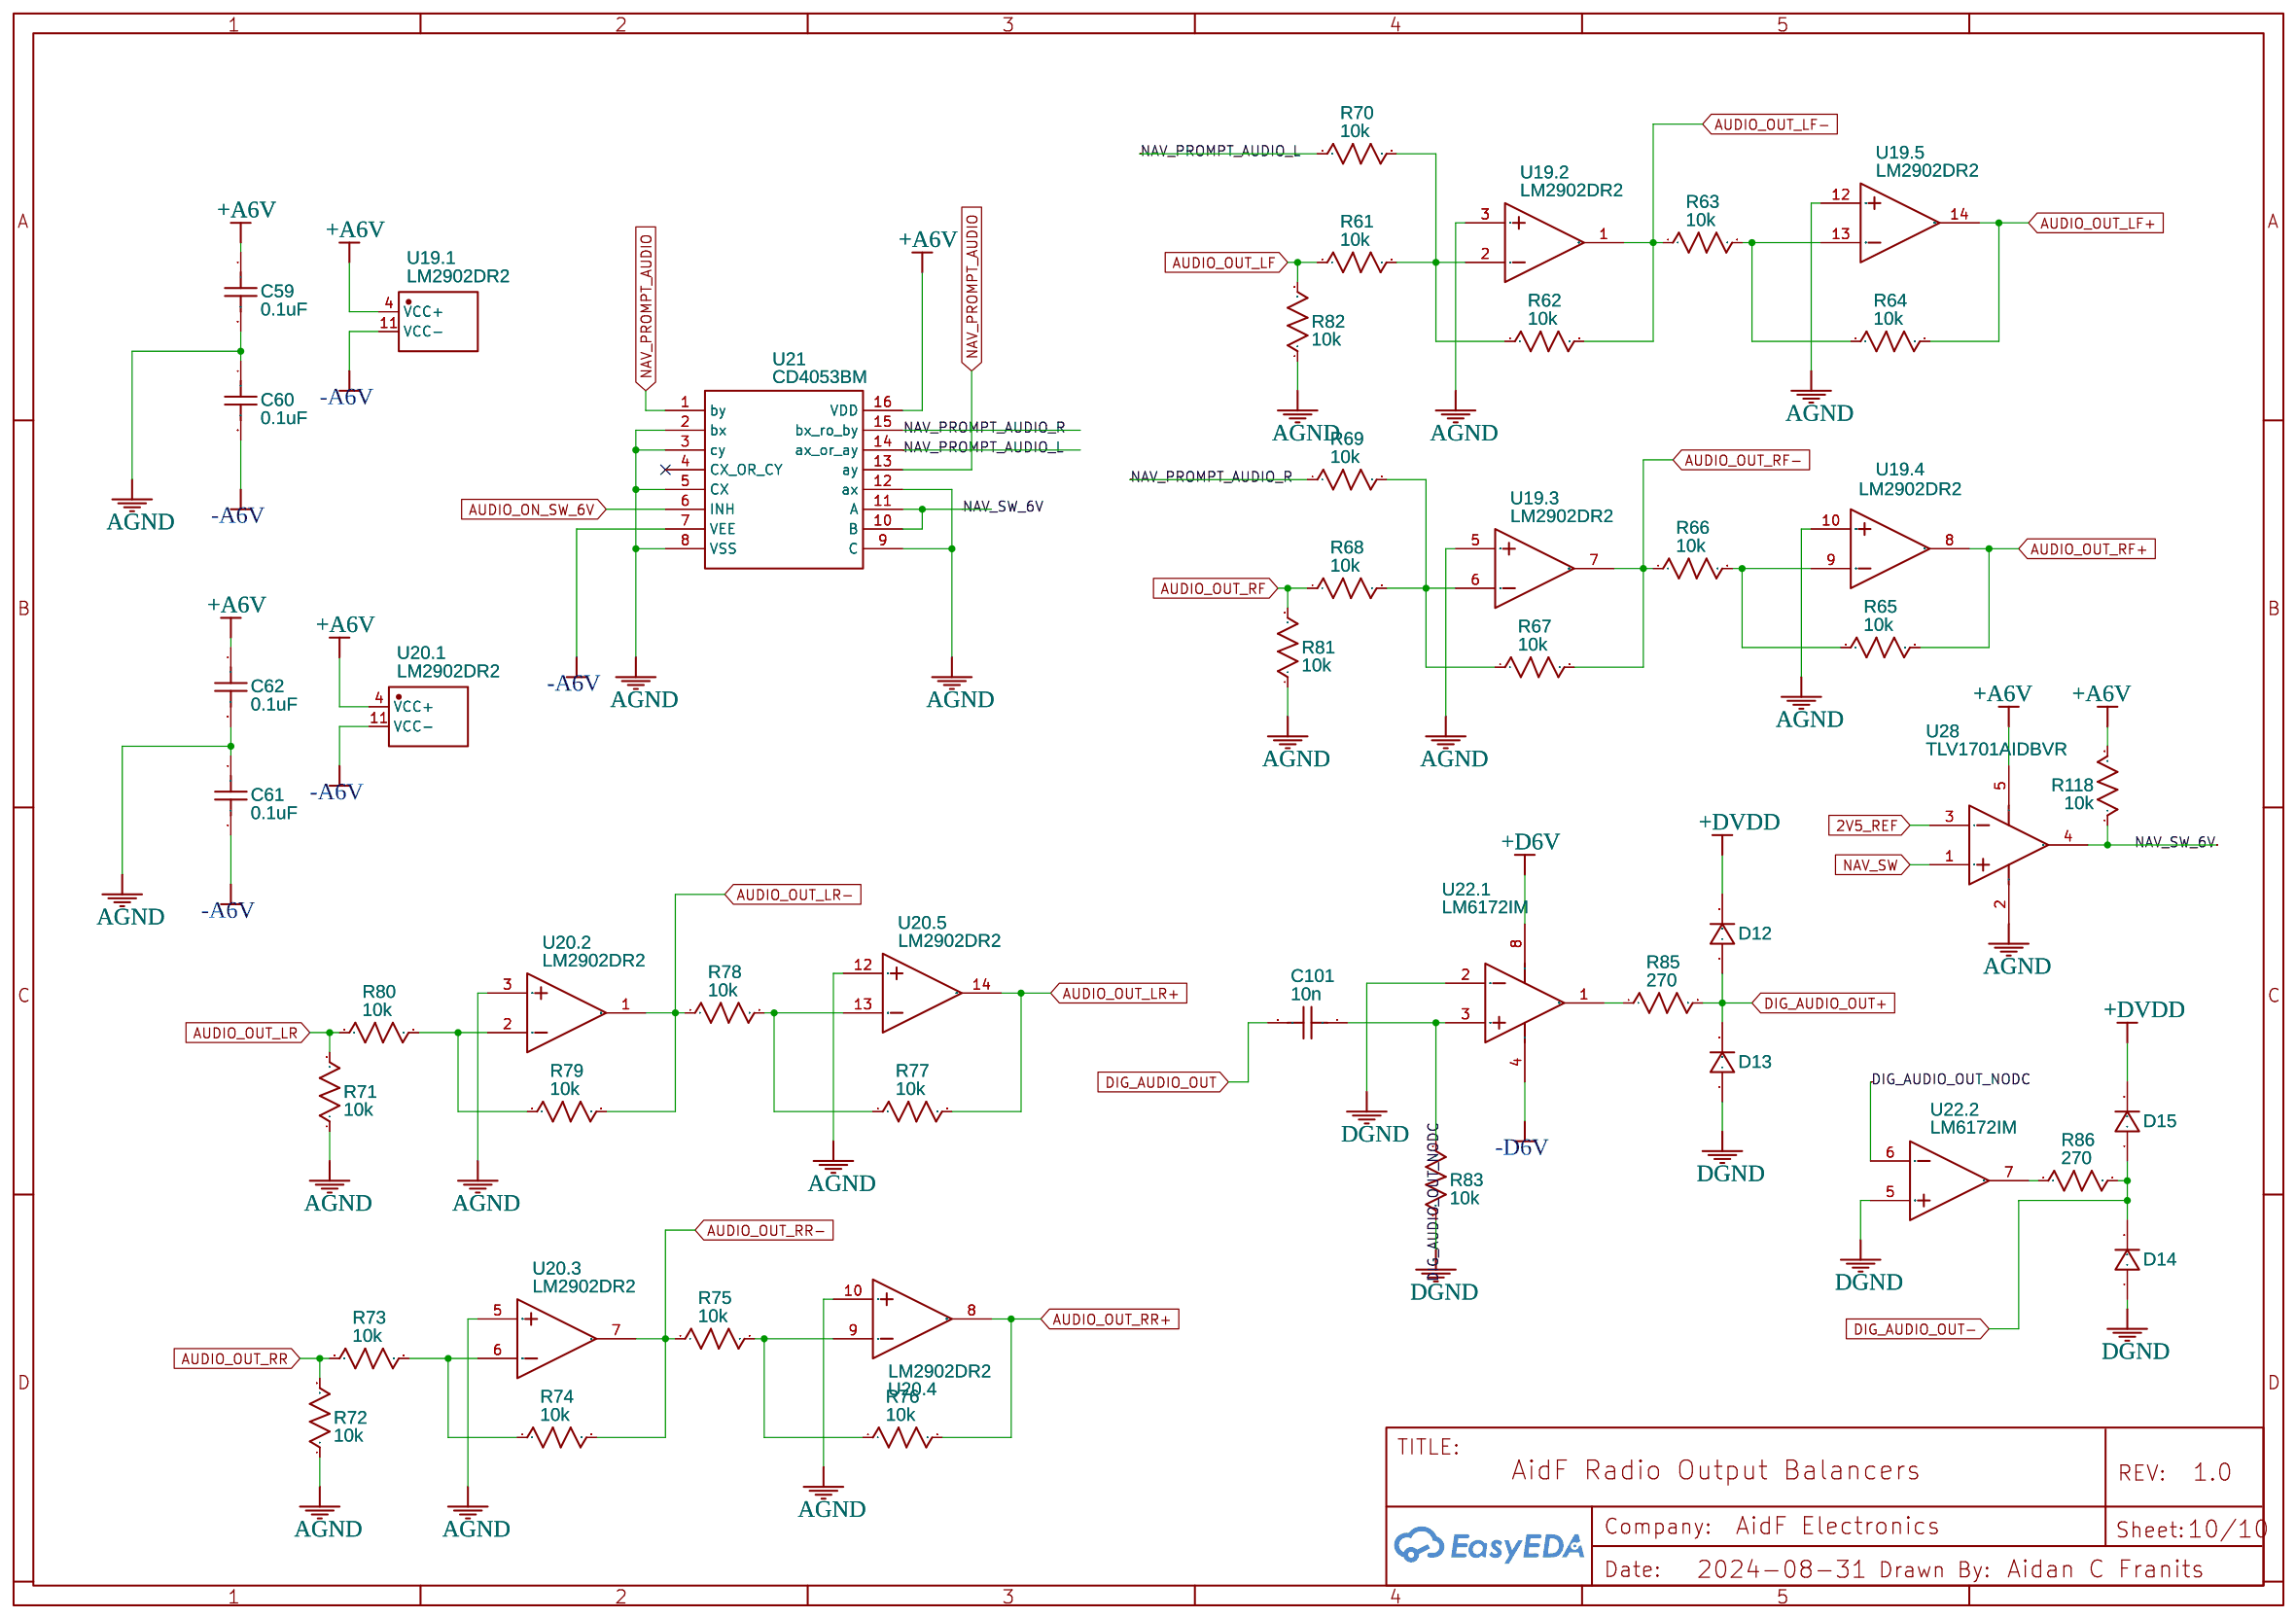
[diagram p9: Output Balancers]

## Parts
sheet AIBus Inlet
C69  0.1uF  [C0603]
R97  10k  [R0603]
R98  10k  [R0603]
R99  10k  [R0603]
U23  MCP2561T-E/SN  [SOIC-8_L4.9-W3.9-P1.27-LS6.0-BL-2]
sheet Antenna Amplifier
C86  68nF  [C0603]
C87  47nF  [C0603]
J7  CONMHF1-SMD-G-T  [RF-SMD_CONMHF1-SMD-G-T]
Q5  MMBT5179  [SOT-23-3_L2.9-W1.3-P1.90-LS2.4-BR]
R112  22  [R0603]
R113  47k  [R0603]
R114  47k  [R0603]
R115  3.3  [R0603]
R116  470  [R0603]
R117  100  [R0603]
sheet Audio Switch
C30  0.1uF  [C0603]
C31  0.1uF  [C0603]
C32  0.1uF  [C0603]
R1  10k  [R0603]
R7  10k  [R0603]
R8  10k  [R0603]
R9  10k  [R0603]
R11  10k  [R0603]
R12  10k  [R0603]
U4  CD4053BM  [SOIC-16_L9.9-W3.9-P1.27-LS6.0-BL]
U5  LM393DTR(XBLW)  [SOIC-8_L4.9-W3.9-P1.27-LS6.0-BL]  (sections 1,2)
sheet Digital Audio Processing
C7  0.1uF  [C0603]
C8  0.1uF  [C0603]
C9  68uF  [C1206]
C10  4.7uF  [C0603]
C11  0.1uF  [C0603]
C12  0.1uF  [C0603]
C13  10uF  [C0805]
C14  0.1uF  [C0603]
C15  0.1uF  [C0603]
C16  0.1uF  [C0603]
C17  0.1uF  [C0603]
C18  0.1uF  [C0603]
C19  2.2uF  [C0603]
C20  2.2uF  [C0603]
C21  22pF  [C0603]
C22  330p  [C0603]
C23  10uF  [C0805]
C24  330p  [C0603]
C25  0.1uF  [C0603]
C26  22pF  [C0603]
C29  0.1uF  [C0603]
C35  0.1uF  [C0603]
C36  0.1uF  [C0603]
R2  10k  [R0603]
R3  20k  [R0603]
R4  20k  [R0603]
R5  10k  [R0603]
R6  10k  [R0603]
R10  10k  [R0603]
R13  680  [R0603]
R14  470  [R0603]
R15  10k  [R0603]
R16  10k  [R0603]
R17  10k  [R0603]
R18  10k  [R0603]
R19  10k  [R0603]
R27  100k  [R0603]
R28  100k  [R0603]
R84  10k  [R0603]
U9  PCM5101APWR  [TSSOP-20_L6.5-W4.4-P0.65-LS6.5-BL]
U10  PCM9211PTR  [TQFP-48_L7.0-W7.0-P0.50-LS9.0-TL]
U11  TL062VD  [SO-8_L4.9-W3.9-P1.27-LS6.0-BL]  (sections 1,2)
X1  24.576MHz  [CRYSTAL-SMD_4P-L3.2-W2.5-BL]
sheet Input De-Balancers
C63  0.1uF  [C0603]
C64  0.1uF  [C0603]
C70  0.1uF  [C0603]
C71  0.1uF  [C0603]
C72  10uF  [C0805]
C73  10uF  [C0805]
R104  10k  [R0603]
R105  20k  [R0603]
R106  20k  [R0603]
R107  10k  [R0603]
R108  1k  [R0603]
R109  1k  [R0603]
U24  LM2904BAQDRQ1  [SOIC-8_L4.9-W3.9-P1.27-LS6.0-BL]  (sections 1,2)
U25  LM321SN3T1G  [TSOP-5_L3.0-W1.5-P0.95-LS2.8-BL]
sheet Main Controller
C1  0.1uF  [C0603]
C2  0.1uF  [C0603]
C3  0.1uF  [C0603]
C33  22pF  [C0603]
C34  22pF  [C0603]
D5  SD103AWS-TP  [SOD-323_L1.8-W1.3-LS2.6-FD]
D6  SD103AWS-TP  [SOD-323_L1.8-W1.3-LS2.6-FD]
D7  SD103AWS-TP  [SOD-323_L1.8-W1.3-LS2.6-FD]
D8  SD103AWS-TP  [SOD-323_L1.8-W1.3-LS2.6-FD]
D9  SD103AWS-TP  [SOD-323_L1.8-W1.3-LS2.6-FD]
D11  SD103AWS-TP  [SOD-323_L1.8-W1.3-LS2.6-FD]
D16  SD103AWS-TP  [SOD-323_L1.8-W1.3-LS2.6-FD]
D17  SD103AWS-TP  [SOD-323_L1.8-W1.3-LS2.6-FD]
D18  SD103AWS-TP  [SOD-323_L1.8-W1.3-LS2.6-FD]
D19  SD103AWS-TP  [SOD-323_L1.8-W1.3-LS2.6-FD]
D20  SD103AWS-TP  [SOD-323_L1.8-W1.3-LS2.6-FD]
J6  PPTC032LFBN-RC  [RHDR6W75P254_2X3_812X508X850P]
R20  470  [R0603]
R21  470  [R0603]
R22  470  [R0603]
R23  470  [R0603]
R119  10k  [R0603]
R120  10k  [R0603]
R121  470  [R0603]
R122  470  [R0603]
R123  10k  [R0603]
U1  AVR128DA32T-E/PT  [TQFP-32_L7.0-W7.0-P0.80-LS9.0-BL]
U6  MCP79410T-I/SN  [SOIC-8_L4.9-W3.9-P1.27-LS6.0-BL]
U7  23K640T-I/SN_C615583  [SOIC-8_L4.9-W3.9-P1.27-LS6.0-BL]
X4  32.768kHz  [CRYSTAL-SMD_L1.6-W1.0]
sheet Output Balancers
C59  0.1uF  [C0603]
C60  0.1uF  [C0603]
C61  0.1uF  [C0603]
C62  0.1uF  [C0603]
C101  10n  [C0603]
D12  SD103AWS-TP  [SOD-323_L1.8-W1.3-LS2.6-FD]
D13  SD103AWS-TP  [SOD-323_L1.8-W1.3-LS2.6-FD]
D14  SD103AWS-TP  [SOD-323_L1.8-W1.3-LS2.6-FD]
D15  SD103AWS-TP  [SOD-323_L1.8-W1.3-LS2.6-FD]
R61  10k  [R0603]
R62  10k  [R0603]
R63  10k  [R0603]
R64  10k  [R0603]
R65  10k  [R0603]
R66  10k  [R0603]
R67  10k  [R0603]
R68  10k  [R0603]
R69  10k  [R0603]
R70  10k  [R0603]
R71  10k  [R0603]
R72  10k  [R0603]
R73  10k  [R0603]
R74  10k  [R0603]
R75  10k  [R0603]
R76  10k  [R0603]
R77  10k  [R0603]
R78  10k  [R0603]
R79  10k  [R0603]
R80  10k  [R0603]
R81  10k  [R0603]
R82  10k  [R0603]
R83  10k  [R0603]
R85  270  [R0603]
R86  270  [R0603]
R118  10k  [R0603]
U19  LM2902DR2  [SOIC-14_L8.7-W3.9-P1.27-LS6.0-BL]  (sections 1,2,3,4,5)
U20  LM2902DR2  [SOIC-14_L8.7-W3.9-P1.27-LS6.0-BL]  (sections 1,2,3,4,5)
U21  CD4053BM  [SOIC-16_L9.9-W3.9-P1.27-LS6.0-BL]
U22  LM6172IM  [SOIC-8_L5.0-W4.0-P1.27-LS6.0-BL]  (sections 1,2)
U28  TLV1701AIDBVR  [SOT-23-5_L3.0-W1.7-P0.95-LS2.8-BR]
sheet Power Inlet
C27  0.1uF  [C0603]
C28  100u  [CAP-D6.3×F2.5]
C74  100u  [CAP-D6.3×F2.5]
C75  100u  [CAP-D6.3×F2.5]
C76  100u  [CAP-D6.3×F2.5]
C77  100u  [CAP-D6.3×F2.5]
C82  0.1uF  [C0603]
C83  0.1uF  [C0603]
C84  0.1uF  [C0603]
C85  0.1uF  [C0603]
D1  5.6V  [SOD-123_L2.7-W1.6-LS3.7-RD-A]
D2  3.6V  [SOD-123_L2.7-W1.6-LS3.7-RD-A]
D3  6.8V  [SOD-123_L2.7-W1.6-LS3.7-RD-A]
D4  6.8V  [SOD-123_L2.7-W1.6-LS3.7-RD-A]
D10  3.6V  [SOD-123_L2.7-W1.6-LS3.7-RD-A]
J1  HDR-M-2.54_1x10  [HDR-M-2.54_1X10]
J2  HDR-M-2.54_1x8  [HDR-M-2.54_1X8]
J3  HDR-M-2.54_1x5  [HDR-M-2.54_1X5]
J4  HDR-M-2.54_1x5  [HDR-M-2.54_1X5]
J5  HDR-M-2.54_1x12  [PH1-12-UA]
L1  1u  [L0603]
L2  1u  [L0603]
L3  1u  [L0603]
L4  1u  [L0603]
L5  1u  [L0603]
L6  1u  [L0603]
L7  1u  [L0603]
L8  1u  [L0603]
L9  1u  [L0603]
L10  1u  [L0603]
L11  1u  [L0603]
L12  1u  [L0603]
L13  1u  [L0603]
Q1  SI2347DS-T1-GE3  [SOT-23-3_L2.9-W1.3-P1.83-LS2.4-BR-1]
Q2  SI2347DS-T1-GE3  [SOT-23-3_L2.9-W1.3-P1.83-LS2.4-BR-1]
Q3  SI2347DS-T1-GE3  [SOT-23-3_L2.9-W1.3-P1.83-LS2.4-BR-1]
Q4  2N7002  [SOT-23_L2.9-W1.3-P0.95-LS2.4-BR]
Q6  SI2347DS-T1-GE3  [SOT-23-3_L2.9-W1.3-P1.83-LS2.4-BR-1]
R110  100  [R0603]
sheet Tuner Array
C4  22pF  [C0603]
C5  22pF  [C0603]
C6  0.1uF  [C0603]
C88  0.1uF  [C0603]
C89  22pF  [C0603]
C90  22pF  [C0603]
C91  0.1uF  [C0603]
C92  0.1uF  [C0603]
C93  4.7uF  [C0603]
C94  4.7uF  [C0603]
C95  0.1uF  [C0603]
C96  0.1uF  [C0603]
R125  10k  [R0603]
R126  10k  [R0603]
U2  Si4731  [QFN-20_L3.0-W3.0-P0.50-BL-EP1.7_SI473X-XXX]
U3  Si4731  [QFN-20_L3.0-W3.0-P0.50-BL-EP1.7_SI473X-XXX]
U29  TL062VD  [SO-8_L4.9-W3.9-P1.27-LS6.0-BL]  (sections 1,2)
X2  32.768kHz  [CRYSTAL-SMD_L1.6-W1.0]
X3  32.768kHz  [CRYSTAL-SMD_L1.6-W1.0]
sheet Volume and Tone
C37  0.1uF  [C0603]
C38  22uF  [C0603]
C39  22uF  [C0603]
C40  22uF  [C0603]
C41  6.8n  [C0603]
C42  0.1uF  [C0603]
C43  22uF  [C0603]
C44  6.8n  [C0603]
C45  0.1uF  [C0603]
C46  1uF  [C0603]
C47  0.1uF  [C0603]
C48  0.1uF  [C0603]
C49  1uF  [C0603]
C50  0.1uF  [C0603]
C51  0.1uF  [C0603]
C52  22uF  [C0603]
C53  22uF  [C0603]
C54  0.1uF  [C0603]
C55  1uF  [C0603]
C56  1uF  [C0603]
C57  1uF  [C0603]
C58  1uF  [C0603]
C65  0.1uF  [C0603]
C66  0.1uF  [C0603]
C97  0.1uF  [C0603]
C98  0.1uF  [C0603]
R29  1k  [R0603]
R30  1k  [R0603]
R35  1k  [R0603]
R36  1k  [R0603]
R39  1k  [R0603]
R40  1k  [R0603]
R41  1k  [R0603]
R42  1k  [R0603]
R45  220  [R0603]
R46  220  [R0603]
R47  220  [R0603]
R48  220  [R0603]
R49  1k  [R0603]
R50  1k  [R0603]
R55  1k  [R0603]
R56  1k  [R0603]
R57  10k  [R0603]
R58  10k  [R0603]
R59  10k  [R0603]
R60  10k  [R0603]
U12  MCP4251T-103E/SL  [SOIC-14_L8.7-W3.9-P1.27-LS6.0-BL]
U13  MCP4251-503E/SL  [SOIC-14_L8.7-W3.9-P1.27-LS6.0-BL]
U14  LM2902DR2  [SOIC-14_L8.7-W3.9-P1.27-LS6.0-BL]  (sections 1,2,3,4,5)
U15  MCP4251T-103E/SL  [SOIC-14_L8.7-W3.9-P1.27-LS6.0-BL]
U16  LM2902DR2  [SOIC-14_L8.7-W3.9-P1.27-LS6.0-BL]  (sections 1,2,3,4,5)
U17  MCP4251T-103E/SL  [SOIC-14_L8.7-W3.9-P1.27-LS6.0-BL]
U18  LM2904BAQDRQ1  [SOIC-8_L4.9-W3.9-P1.27-LS6.0-BL]  (sections 1,2)
U30  LM2904BAQDRQ1  [SOIC-8_L4.9-W3.9-P1.27-LS6.0-BL]  (sections 1,2)

## Library data of the parts
C1-C3 C6-C8 C11 C12 C14-C18 C25 C27 C29-C32 C35-C37 C42 C45 C47 C48 C50 C51 C54 C59-C66 C69-C71 C82-C85 C88 C91 C92 C95-C98 = C_0603_US: Supplier Part: 1292-1392-1-ND; Supplier: Digi-Key; Contributor: LCEDA_Lib; Manufacturer Part: 0603B104K101CT; Manufacturer: Walsin Technology Corporation
R1 R2 R5-R12 R15-R19 R57-R84 R97-R99 R104 R107 R118-R120 R123 R125 R126 = R_0603_US: Supplier Part: RNCP0603FTD10K0CT-ND; Supplier: Digi-Key; Contributor: LCEDA_Lib; Manufacturer Part: RNCP0603FTD10K0; Manufacturer: Stackpole Electronics Inc
U23 = MCP2551T-I/SN: Supplier: Digi-Key; Manufacturer: Microchip Technology; Supplier Part: MCP2561T-E/SNCT-ND; JLCPCB Part Class: Extended Part
C86 = C_0603_US: Supplier Part: 1276-6541-1-ND; Supplier: Digi-Key; Contributor: LCEDA_Lib; Manufacturer Part: CL10B683KB8WPNC; Manufacturer: Samsung Electro-Mechanics
C87 = C_0603_US: Supplier Part: 490-5854-1-ND; Supplier: Digi-Key; Contributor: LCEDA_Lib; Manufacturer Part: GCJ188R71H473KA12D; Manufacturer: Murata Electronics
J7 = CONMHF1-SMD-G-T: Supplier: Digi-Key; Supplier Part: 343-CONMHF1-SMD-G-TCT-ND; Manufacturer: TE Connectivity Linx; Contributor: lcsc; JLCPCB Part Class: Extended Part
Q5 = MMBT5179: Contributor: LCSC; Supplier: Digi-Key; Supplier Part: MMBT5179CT-ND; JLCPCB Part Class: Extended Part
R112 = R_0603_US: Supplier Part: 311-22.0HRCT-ND; Supplier: Digi-Key; Contributor: LCEDA_Lib; Manufacturer Part: RC0603FR-0722RL; Manufacturer: YAGEO
R113 R114 = R_0603_US: Supplier Part: 311-47.0KHRCT-ND; Supplier: Digi-Key; Contributor: LCEDA_Lib; Manufacturer Part: RC0603FR-0747KL; Manufacturer: YAGEO
R115 = R_0603_US: Supplier Part: RMCF0603FT3R30CT-ND; Supplier: Digi-Key; Contributor: LCEDA_Lib; Manufacturer Part: RMCF0603FT3R30; Manufacturer: Stackpole Electronics Inc
R14 R20-R23 R116 R121 R122 = R_0603_US: Supplier Part: 311-470GRCT-ND; Supplier: Digi-Key; Contributor: LCEDA_Lib; Manufacturer Part: RC0603JR-07470RL; Manufacturer: YAGEO
R110 R117 = R_0603_US: Supplier Part: P100HCT-ND; Supplier: Digi-Key; Contributor: LCEDA_Lib; Manufacturer Part: ERJ-3EKF1000V; Manufacturer: Panasonic Electronic Components
U4 U21 = CD4053BM: Contributor: LCSC; Supplier: Digi-Key; Supplier Part: 296-14274-1-ND; Manufacturer: Texas Instruments; Manufacturer Part: CD4053BM96; JLCPCB Part Class: Extended Part
U5 = LM393DTR(XBLW): Supplier: LCSC; Supplier Part: C18723572; Manufacturer: XBLW(芯伯乐); subpart_no: 1; JLCPCB Part Class: Extended Part
C9 = C_0603_US: Supplier Part: 445-14673-1-ND; Supplier: Digi-Key; Contributor: LCEDA_Lib; Manufacturer Part: C3216X5R1A686M160AC; Manufacturer: TDK Corporation
C10 = C_0603_US: Supplier Part: 1276-1784-1-ND; Supplier: Digi-Key; Contributor: LCEDA_Lib; Manufacturer Part: CL10A475KO8NNNC; Manufacturer: Samsung Electro-Mechanics
C13 C23 C72 C73 = C_0603_US: Supplier Part: 1276-2891-1-ND; Supplier: Digi-Key; Contributor: LCEDA_Lib; Manufacturer Part: CL21A106KAYNNNE; Manufacturer: Samsung Electro-Mechanics
C19 C20 = C_0603_US: Supplier Part: 490-10731-1-ND; Supplier: Digi-Key; Contributor: LCEDA_Lib; Manufacturer Part: GRM188R61E225KA12D; Manufacturer: Murata Electronics
C4 C5 C21 C26 C33 C34 C89 C90 = C_0603_US: Supplier Part: 1292-1500-2-ND; Supplier: Digi-Key; Contributor: LCEDA_Lib; Manufacturer Part: 0603N220F500CT; Manufacturer: Walsin Technology Corporation
C22 C24 = C_0603_US: Supplier Part: 478-KGM15ACG1H331FTCT-ND; Supplier: Digi-Key; Contributor: LCEDA_Lib; Manufacturer Part: KGM15ACG1H331FT; Manufacturer: KYOCERA AVX
R3 R4 R105 R106 = R_0603_US: Supplier Part: P20.0KHCT-ND; Supplier: Digi-Key; Contributor: LCEDA_Lib; Manufacturer Part: ERJ-3EKF2002V; Manufacturer: Panasonic Electronic Components
R13 = R_0603_US: Supplier Part: 311-680GRCT-ND; Supplier: Digi-Key; Contributor: LCEDA_Lib; Manufacturer Part: RC0603JR-07680RL; Manufacturer: YAGEO
R27 R28 = R_0603_US: Supplier Part: 311-100KHRCT-ND; Supplier: Digi-Key; Contributor: LCEDA_Lib; Manufacturer Part: RC0603FR-07100KL; Manufacturer: YAGEO
U9 = PCM5101APWR: Contributor: LCSC; Supplier: Digi-Key; Supplier Part: 296-36706-1-ND; Manufacturer: Texas Instruments; JLCPCB Part Class: Extended Part
U10 = PCM9211PTR: Contributor: LCSC; Supplier: Digi-Key; Manufacturer: Texas Instruments; Supplier Part: 296-27688-1-ND; JLCPCB Part Class: Extended Part
U11 U29 = TL062VD: subpart_no: 1; Supplier: Digi-Key; Supplier Part: 296-1281-1-ND; Manufacturer: Texas Instruments; Manufacturer Part: TL062CDR
X1 = ABM8G-24.000MHZ-4Y-T3: Contributor: LCSC; Supplier: Digi-Key; Supplier Part: 535-10914-1-ND; Manufacturer: Abracon LLC; Manufacturer Part: ABM8G-24.576MHZ-4Y-T3; JLCPCB Part Class: Extended Part
R29 R30 R35 R36 R39-R42 R49 R50 R55 R56 R108 R109 = R_0603_US: Supplier Part: 311-1.00KHRCT-ND; Supplier: Digi-Key; Contributor: LCEDA_Lib; Manufacturer Part: RC0603FR-071KL; Manufacturer: YAGEO
U18 U24 U30 = LM2904BAQDRQ1: subpart_no: 1; Supplier: Digi-Key; Supplier Part: 296-LM2904BIDRCT-ND; Manufacturer: Texas Instruments; Manufacturer Part: LM2904BIDR; JLCPCB Part Class: Extended Part
U25 = LM321SN3T1G: Contributor: LCSC; Supplier: Digi-Key; Supplier Part: LM321SN3T1GOSCT-ND; Manufacturer: onsemi; JLCPCB Part Class: Extended Part
D5-D9 D11-D20 = 1N4148: Supplier: Digi-Key; Supplier Part: SD103AWSTPMSCT-ND; Manufacturer: Micro Commercial Co; Contributor: LCSC
J6 = PPTC032LFBN-RC: Contributor: achinya_m; Supplier: Digi-Key; Supplier Part: S7071-ND; Manufacturer: Sullins Connector Solutions
U1 = AVR128DA32T-E/PT: Contributor: lcsc; Supplier: Digi-Key; Supplier Part: 150-AVR128DA32T-E/PTCT-ND; Manufacturer: Microchip Technology
U6 = MCP79410T-I/SN: Contributor: LCSC; Supplier: Digi-Key; Supplier Part: MCP79410T-I/SNCT-ND; Manufacturer: Microchip Technology; JLCPCB Part Class: Extended Part
U7 = 23K640T-I/SN_C615583: Contributor: LCSC; Supplier: Digi-Key; Supplier Part: 23K640T-I/SNCT-ND; Manufacturer: Microchip Technology; Manufacturer Part: 23K640T-I/SN; JLCPCB Part Class: Extended Part
X2-X4 = SC16S-7PF20PPM: Supplier: Digi-Key; Supplier Part: 728-1129-1-ND; Manufacturer: Seiko Instruments; JLCPCB Part Class: Extended Part; Contributor: lcsc
C101 = C_0603_US: Supplier Part: 490-4781-1-ND; Supplier: Digi-Key; Contributor: LCEDA_Lib; Manufacturer Part: GCM188R72A103KA37D; Manufacturer: Murata Electronics
R85 R86 = R_0603_US: Supplier Part: 311-270HRCT-ND; Supplier: Digi-Key; Contributor: LCEDA_Lib; Manufacturer Part: RC0603FR-07270RL; Manufacturer: YAGEO
U14 U16 U19 U20 = LM2902DR2: subpart_no: 1; Supplier: Digi-Key; Supplier Part: 296-14594-1-ND; Manufacturer: Texas Instruments; Manufacturer Part: LM2902DR
U22 = LM6172IM: subpart_no: 1; Supplier: Digi-Key; Supplier Part: LM6172IMX/NOPBCT-ND; Manufacturer: Texas Instruments; Manufacturer Part: LM6172IMX/NOPB
U28 = TLV1701AIDBVR: Contributor: LCSC; Supplier: Digi-Key; Manufacturer: Texas Instruments; Supplier Part: 296-40599-1-ND; JLCPCB Part Class: Extended Part
C28 C74-C77 = CE_TH_D6.3×F2.5_US: Supplier Part: 399-6650-1-ND; Supplier: Digi-Key; Contributor: LCEDA_Lib; Manufacturer Part: ESK107M025AE3EA; Manufacturer: KEMET
D1 = BZT52C12-TP: Contributor: LCSC; Supplier: Digi-Key; Supplier Part: MMSZ5232BT1GOSCT-ND; Manufacturer: onsemi; Manufacturer Part: MMSZ5232BT1G; JLCPCB Part Class: Extended Part
D2 D10 = BZT52C12-TP: Contributor: LCSC; Supplier: Digi-Key; Supplier Part: MMSZ4685-TPMSCT-ND; Manufacturer: Micro Commercial Co; Manufacturer Part: MMSZ4685-TP; JLCPCB Part Class: Extended Part
D3 D4 = BZT52C12-TP: Contributor: LCSC; Supplier: Digi-Key; Supplier Part: MMSZ4692T1GOSCT-ND; Manufacturer: onsemi; Manufacturer Part: MMSZ4692T1G; JLCPCB Part Class: Extended Part
J1 = HDR-M-2.54_1x10: Supplier Part: 2057-PH1-10-UA-ND; Supplier: Digi-Key; Manufacturer: Adam Tech; Manufacturer Part: PH1-10-UA; Contributor: LCEDA_Lib
J2 = HDR-M-2.54_1x8: Supplier Part: 2057-PH1-08-UA-ND; Supplier: Digi-Key; Manufacturer: Adam Tech; Manufacturer Part: PH1-08-UA; Contributor: LCEDA_Lib
J3 J4 = HDR-M-2.54_1x5: Supplier Part: 2057-PH1-05-UA-ND; Supplier: Digi-Key; Manufacturer: Adam Tech; Manufacturer Part: PH1-05-UA; Contributor: LCEDA_Lib
J5 = CONN HEADER VERT 12POS 2.54MM: Manufacturer: Adam Tech; Supplier: Digi-Key; Supplier Part: 2057-PH1-12-UA-ND; link: https://app.adam-tech.com/products/download/data_sheet/201605/ph1-xx-ua-data-sheet.pdf; Contributor: the_basketcase
L1-L13 = L0603_US: Supplier Part: 445-174936-1-ND; Supplier: Digi-Key; Contributor: LCEDA_Lib; Manufacturer Part: MAF1608FAD151CT000; Manufacturer: TDK Corporation
Q1-Q3 Q6 = IRF5210: Supplier: Digi-Key; Manufacturer: Vishay Siliconix; Supplier Part: SI2347DS-T1-GE3CT-ND; Contributor: LCEDA_Lib
Q4 = 2N7002: Supplier: Digi-Key; Manufacturer: Diodes Incorporated; Manufacturer Part: DMN3404L-7; image: //image.lceda.cn/szlcsc/C65189.jpg; Supplier Part: DMN3404LDICT-ND; Paste Type: expand; Contributor: LCEDA_Lib
C93 C94 = C_0603_US: Supplier Part: 490-12328-1-ND; Supplier: Digi-Key; Contributor: LCEDA_Lib; Manufacturer Part: GRT188R61E475KE13D; Manufacturer: Murata Electronics
U2 U3 = SI4731-D60-GMR: Contributor: LCSC; Supplier: Digi-Key; Supplier Part: SI4731-D60-GM-ND; Manufacturer: Skyworks Solutions Inc.; JLCPCB Part Class: Extended Part
C38-C40 C43 C52 C53 = C_0603_US: Supplier Part: 490-GRM188C61C226ME01WCT-ND; Supplier: Digi-Key; Contributor: LCEDA_Lib; Manufacturer Part: GRM188C61C226ME01W; Manufacturer: Murata Electronics
C41 C44 = C_0603_US: Supplier Part: 445-7402-1-ND; Supplier: Digi-Key; Contributor: LCEDA_Lib; Manufacturer Part: C1608C0G1H682J080AA; Manufacturer: TDK Corporation
C46 C49 C55-C58 = C_0603_US: Supplier Part: 311-1445-1-ND; Supplier: Digi-Key; Contributor: LCEDA_Lib; Manufacturer Part: CC0603KRX5R8BB105; Manufacturer: YAGEO
R45-R48 = R_0603_US: Supplier Part: RMCF0603JT220RCT-ND; Supplier: Digi-Key; Contributor: LCEDA_Lib; Manufacturer Part: RMCF0603JT220R; Manufacturer: Stackpole Electronics Inc
U12 U15 U17 = MCP4251T-103E/SL: Contributor: lcsc; Supplier: Digi-Key; Supplier Part: MCP4251T-103E/SLCT-ND; Manufacturer: Microchip Technology; JLCPCB Part Class: Extended Part
U13 = MCP4251T-103E/SL: Contributor: lcsc; Supplier: Digi-Key; Supplier Part: MCP4251-503E/SL-ND; Manufacturer: Microchip Technology; JLCPCB Part Class: Extended Part

## Nets
2V5_REF: R11.1 R12.2 U5.2(1IN-) U5.6(2IN-) U16.5(+INB) U16.10(+INC) U28.3(-IN)
2V5_REF_L: C41.1 R47.2 U12.5(P1B) U16.6(-INB) U16.7(OUTB) U17.5(P1B)
2V5_REF_R: C44.1 R48.2 U12.10(P0B) U16.8(OUTC) U16.9(-INC) U17.10(P0B)
+3.3V: C18.2 C75.1 C83.2 D2.1(K) D16.1 L3.1 L4.1 Q2.2(S) U9.1(CPVDD)
+3V3_IN: J1.2 Q2.3(D)
+3V_C_IN: J1.4 Q6.3(D)
+3VC: C27.2 C28.1 D10.1(K) D11.1 Q6.2(S) U6.3(VBAT)
+5V: C1.2 C2.2 C3.2 C69.2 C74.1 C82.2 D1.1(K) J6.2 L1.1 L2.1 Q1.2(S) R7.1 R12.1 R98.1 R99.1 U1.18(AVDD) U1.28(VDD) U6.8(VCC) U23.3(VDD)
+5V_IN: J1.1 Q1.3(D)
+6V: C76.1 C84.2 D3.1(K) L7.1 L8.1 L13.1 Q3.2(S)
+6V_IN: J1.3 Q3.3(D)
+A6V: C25.1 C30.1 C32.1 C48.1 C50.1 C59.1 C62.1 C63.1 C65.1 C71.1 C95.1 C97.1 L8.2 R1.1 R8.1 R118.2 U4.16(VDD) U5.8(VDD) U11.8(VCC) U14.4(VCC+) U16.4(VCC+) U18.8(V+) U19.4(VCC+) U20.4(VCC+) U21.16(VDD) U24.8(V+) U25.5(VCC) U28.5(+V) U29.8(VCC) U30.8(V+)
+AVDD: C6.2 C7.2 C92.2 L1.2 U2.11(VA) U3.11(VA) U10.46(VCCAD)
+D6V: L7.2 U22.8(V+)
+DVDD: C14.2 C15.2 C16.2 C88.2 C91.2 D5.2 D6.2 D7.2 D8.2 D9.2 D12.2 D15.2 L4.2 U2.6(SEN#) U2.10(VD) U2.19(GPO1) U3.10(VD) U3.19(GPO1) U9.8(AVDD) U9.20(DVDD) U10.22(DVDD) U10.27(MODE) U10.34(RST#) U10.36(VDDRX)
+PVDD: C8.2 C9.1 C10.1 L3.2 U10.42(VCC)
-6V: C77.2 C85.2 D4.2(A) L5.1 L6.1 Q4.2(S)
-6V_IN: J1.6 Q4.3(D)
-A6V: C29.2 C31.2 C45.2 C51.2 C60.2 C61.2 C64.2 C66.2 C70.2 C96.2 C98.2 L5.2 U4.7(VEE) U11.4(VEE) U14.11(VCC-) U16.11(VCC-) U18.4(V-) U19.11(VCC-) U20.11(VCC-) U21.7(VEE) U24.4(V-) U25.2(VEE) U29.4(VEE) U30.4(V-)
-D6V: L6.2 U22.4(V-)
AGND: C7.1 C11.2 C12.2 C21.1 C25.2 C26.1 C29.1 C30.2 C31.1 C32.2 C45.1 C48.2 C50.2 C51.1 C59.2 C60.1 C61.1 C62.2 C63.2 C64.1 C65.2 C66.1 C70.1 C71.2 C95.2 C96.1 C97.2 C98.1 J3.3 L12.2 R27.1 R28.1 R57.2 R58.2 R59.2 R60.2 R71.1 R72.1 R81.1 R82.1 R107.1 R108.2 R109.2 R125.2 R126.2 U4.3(cy) U4.5(CX) U4.8(VSS) U4.9(C) U5.4(GND) U9.9(AGND) U10.45(AGNDAD) U19.3(+INA) U19.5(+INB) U19.10(+INC) U19.12(+IND) U20.3(+INA) U20.5(+INB) U20.10(+INC) U20.12(+IND) U21.2(bx) U21.3(cy) U21.5(CX) U21.8(VSS) U21.9(C) U21.12(ax) U28.2(-V)
DGND: C14.1 C15.1 C16.1 C17.1 C20.1 D13.1 D14.1 L11.2 R2.1 R10.1 R15.1 R16.1 R17.1 R18.1 R19.1 R83.2 R84.1 U9.10(DEMP) U9.16(FMT) U9.19(DGND) U10.21(DGND) U10.38(GNDRX) U22.2(INA-) U22.5(INB+)
GND: C1.1 C2.1 C3.1 C4.1 C5.1 C6.1 C18.1 C27.1 C28.2 C33.1 C34.1 C37.2 C42.2 C47.2 C54.2 C69.1 C74.2 C75.2 C76.2 C77.1 C82.1 C83.1 C84.1 C85.1 C88.1 C89.1 C90.1 C91.1 C92.1 D1.2(A) D2.2(A) D3.2(A) D4.1(K) D10.2(A) J1.5 J1.7 J3.5 J4.4 J4.5 J5.9 J5.10 J6.6 J7.2 J7.3 J7.4 L9.1 L10.1 L11.1 L12.1 Q1.1(G) Q2.1(G) Q3.1(G) Q4.1(G) Q6.1(G) R9.2 R11.2 R30.2 R35.2 R39.2 R42.2 R50.2 R55.2 R97.2 R114.1 R115.1 R117.1 U1.19(GND) U1.29(GND) U2.12(GND) U2.18(GPO2/[INT]#) U2.21(GND) U3.6(SEN#) U3.12(GND) U3.18(GPO2/[INT]#) U3.21(GND) U6.4(VSS) U7.4(VSS) U9.3(CPGND) U12.4(VSS) U13.4(VSS) U15.4(VSS) U17.4(VSS) U23.2(VSS)
PGND: C8.1 L10.2 U10.41(AGND)
+MVDD: D11.2 D16.2 D17.2 D18.2 D19.2 D20.2 U7.7(HOLD#) U7.8(VCC)
+R6V: L13.2 R113.2 R116.2
+VVDD: C37.1 C42.1 C47.1 C54.1 L2.2 R29.1 R36.1 R40.1 R41.1 R49.1 R56.1 U12.11(WP#) U12.14(VDD) U13.11(WP#) U13.14(VDD) U15.11(WP#) U15.14(VDD) U17.11(WP#) U17.14(VDD)
ADC_COM: C11.1 C12.1 U10.44(VCOM) U11.3(Inputs 1+) U11.5(Inputs 2+)
ADC_CS: U1.14(PD4) U10.26(MS/ADR1)
ADC_IN_L: C22.2 R5.2 U10.47(VINL) U11.1(Output 1)
ADC_IN_R: C24.2 R6.2 U10.48(VINR) U11.7(Output 2)
AI_RX: R99.2 U1.5(PA7) U1.31(PA1) U23.4(RXD)
AI_TX: R98.2 U1.30(PA0(EXTCLK)) U23.1(TXD)
AIBUS+: J1.8 R110.2 U23.7(CANH)
AIBUS-: J1.9 R110.1 U23.6(CANL)
ANA_AUDIO_BUF_L: C39.1 U30.1(OUT1) U30.2(IN1-)
ANA_AUDIO_BUF_R: C43.2 U30.6(IN2-) U30.7(OUT2)
ANTENNA_OUT: C87.1 R117.2 U2.2(FMI) U2.4(AMI) U3.2(FMI) U3.4(AMI)
AUDIO_IN_L: C13.2 U4.14(ax or ay)
AUDIO_IN_R: C23.2 U4.15(bx ro by)
AUDIO_ON_SW: R7.2 U1.9(PC3) U5.3(1IN+)
AUDIO_ON_SW_6V: R8.2 U4.6(INH) U5.1(1OUT) U21.6(INH)
AUDIO_OUT_LF: C55.2 R57.1 R61.1 R82.2
AUDIO_OUT_LF+: J5.1 R64.2 U19.14(OUTD)
AUDIO_OUT_LF-: J5.2 R62.2 R63.1 U19.1(OUTA)
AUDIO_OUT_LR: C57.2 R59.1 R71.2 R80.1
AUDIO_OUT_LR+: J5.3 R77.2 U20.14(OUTD)
AUDIO_OUT_LR-: J5.4 R78.1 R79.2 U20.1(OUTA)
AUDIO_OUT_RF: C56.2 R58.1 R68.1 R81.2
AUDIO_OUT_RF+: J5.5 R65.2 U19.8(OUTC)
AUDIO_OUT_RF-: J5.6 R66.1 R67.2 U19.7(OUTB)
AUDIO_OUT_RR: C58.2 R60.1 R72.2 R73.1
AUDIO_OUT_RR+: J5.7 R76.2 U20.8(OUTC)
AUDIO_OUT_RR-: J5.8 R74.2 R75.1 U20.7(OUTB)
AUDIO_SW: R9.1 U1.7(PC1) U5.5(2IN+)
AUDIO_SW_6V: R1.2 U4.10(B) U4.11(A) U5.7(2OUT)
AUX_IN_L: C72.2 J3.1
AUX_IN_R: C73.2 J3.2
AUX_OUT_L: U4.13(ay) U24.1(OUT1) U24.3(IN1+)
AUX_OUT_R: U4.1(by) U24.5(IN2+) U24.7(OUT2)
AUX_SW: J3.4 U1.11(PD1)
B_AUDIO_OUT_L: C49.2 U15.7(P1A) U18.3(IN1+)
B_AUDIO_OUT_R: C46.1 U15.8(P0A) U18.5(IN2+)
BASS_CS: U1.22(PF2) U15.1(CS#)
CLK: R22.2 U1.4(PA6) U10.25(MC/SCL) U12.2(SCK) U13.2(SCK) U15.2(SCK) U17.2(SCK)
DAC_BCK: U9.13(BCK) U10.19(BCK)
DAC_DATA: U9.14(DIN) U10.17(DOUT)
DAC_FILTER_MODE: D6.1 R119.1 U9.11(FLT)
DAC_LRCK: U9.15(LRCK) U10.18(LRCK)
DAC_MUTE: D5.1 R120.2 U9.17(XSMT)
DAC_OUT_L: C35.1 R27.2 U30.3(IN1+)
DAC_OUT_R: C36.1 R28.2 U30.5(IN2+)
DAC_SCK: U9.12(SCK) U10.20(SCKO)
DIG_AUDIO_OUT: C101.2 U10.15(MPO0)
DIG_AUDIO_OUT+: D12.1 D13.2 J5.11 R85.2
DIG_AUDIO_OUT-: D14.2 D15.1 J5.12 R86.2
DIG_AUDIO_OUT_NODC: C101.1 R83.1 U22.3(INA+) U22.6(INB-)
DIG_ERROR: U1.25(PF5) U10.1(ERROR/INT0)
EXT_I2S_BCLK: J2.2 U10.12(MPIO_B1)
EXT_I2S_DIN: J2.1 U10.14(MPIO_B3)
EXT_I2S_LRCK: J2.3 U10.13(MPIO_B2)
EXT_I2S_SCLK: J2.4 U10.11(MPIO_B0)
FADE_CS: U1.17(PD7) U17.1(CS#)
FULL_POWER_ON: J1.10 U1.10(PD0)
I2C_CLK: D7.1 R122.1 U2.7(SCLK) U3.7(SCLK)
I2C_CLK_5V: R122.2 U1.1(PA3) U6.6(SCL)
I2C_DATA: D8.1 R121.2 U2.8(SDIO) U3.8(SDIO)
I2C_DATA_5V: R121.1 U1.32(PA2) U6.5(SDA)
NAV_MUTE: J4.1 U1.23(PF3)
NAV_PROMPT_AUDIO: R104.1 U21.1(by) U21.13(ay) U25.4(OUT)
NAV_PROMPT_AUDIO+: J4.3 R106.1
NAV_PROMPT_AUDIO-: J4.2 R105.1
NAV_PROMPT_AUDIO_L: R70.1 U21.14(ax or ay)
NAV_PROMPT_AUDIO_R: R69.1 U21.15(bx ro by)
NAV_SW: U1.8(PC2) U28.1(+IN)
NAV_SW_6V: R118.1 U21.10(B) U21.11(A) U28.4(OUT)
PI_I2S_BCLK: J2.6 U10.8(MPIO_C1)
PI_I2S_DIN: J2.5 U10.10(MPIO_C3)
PI_I2S_LRCK: J2.7 U10.9(MPIO_C2)
PI_I2S_SCLK: J2.8 U10.7(MPIO_C0)
PICO: R21.1 U1.3(PA5) U10.23(MDO/ADR0) U12.13(SDO) U13.13(SDO) U15.13(SDO) U17.13(SDO)
POCI: R23.2 U1.2(PA4) U10.24(MDI/SDA) U12.3(SDI) U13.3(SDI) U15.3(SDI) U17.3(SDI)
POWER_ON_SW: U12.12(SHDN#) U13.12(SHDN#) U15.12(SHDN#) U17.12(SHDN#)
PRE_DAC_OUT_L: C35.2 U9.6(OUTL)
PRE_DAC_OUT_R: C36.2 U9.7(OUTR)
PROG_RX: J6.4 U1.21(PF1(XTAL32K2))
PROG_TX: J6.5 U1.20(PF0(XTAL32K1))
PROG_UPDI: J6.1 U1.27(UPDI)
RAM_CS: R20.1 U1.24(PF4)
RGND: L9.2 U2.3(RFGND) U3.3(RFGND)
T_AUDIO_OUT_L: C41.2 R45.2 U16.3(+INA)
T_AUDIO_OUT_R: C44.2 R46.2 U16.12(+IND)
TREBLE_CS: U1.16(PD6) U13.1(CS#)
TUNER_OUT_HPF_L: C93.1 R125.1 U29.3(Inputs 1+)
TUNER_OUT_HPF_R: C94.1 R126.1 U29.5(Inputs 2+)
TUNER_OUT_L: U4.12(ax) U29.1(Output 1) U29.2(Inputs 1-)
TUNER_OUT_PRE_L: C93.2 U2.14(LOUT/[DFS])
TUNER_OUT_PRE_R: C94.2 U2.13(ROUT/[DOUT])
TUNER_OUT_R: U4.2(bx) U29.6(Inputs 2-) U29.7(Output 2)
TUNER_RESET: D9.1 R123.1 U2.5(RST#) U3.5(RST#)
TUNER_RESET_UNPROTECTED: R123.2 U1.6(PC0)
VF_AUDIO_OUT_L: U12.6(P1W) U14.3(+INA)
VF_AUDIO_OUT_R: U12.9(P0W) U14.12(+IND)
VOL_CS: U1.15(PD5) U12.1(CS#)
VR_AUDIO_OUT_L: U14.5(+INB) U17.6(P1W)
VR_AUDIO_OUT_R: U14.10(+INC) U17.9(P0W)
Net-(C4-2): C4.2 U3.17(GPO3/[DCLK]) X3.2(GND)
Net-(C5-2): C5.2 U3.9(RCLK) X3.1
Net-(C9-2): C9.2 R13.1
Net-(C10-2): C10.2 R13.2 U10.43(FILT)
Net-(C13-1): C13.1 R3.1
Net-(C17-2): C17.2 U9.18(LDOO)
Net-(C19-1): C19.1 U9.4(CAPM)
Net-(C19-2): C19.2 U9.2(CAPP)
Net-(C20-2): C20.2 U9.5(VNEG)
Net-(C21-2): C21.2 U10.39(XTI) X1.3(OSC2)
Net-(C22-1): C22.1 R3.2 R5.1 U11.2(Inputs 1-)
Net-(C23-1): C23.1 R4.1
Net-(C24-1): C24.1 R4.2 R6.1 U11.6(Inputs 2-)
Net-(C26-2): C26.2 R14.1 X1.1(OSC1)
Net-(C33-2): C33.2 U6.2(X2) X4.1
Net-(C34-2): C34.2 U6.1(X1) X4.2(GND)
Net-(C38-1): C38.1 C53.1 U18.1(OUT1) U18.2(IN1-)
Net-(C38-2): C38.2 R29.2 R30.1 U12.7(P1A)
Net-(C39-2): C39.2 R39.1 R40.2 U13.7(P1A)
Net-(C40-1): C40.1 C52.1 U18.6(IN2-) U18.7(OUT2)
Net-(C40-2): C40.2 R35.1 R36.2 U12.8(P0A)
Net-(C43-1): C43.1 R41.2 R42.1 U13.8(P0A)
Net-(C46-2): C46.2 U16.13(-IND) U16.14(OUTD)
Net-(C49-1): C49.1 U16.1(OUTA) U16.2(-INA)
Net-(C52-2): C52.2 R49.2 R50.1 U17.8(P0A)
Net-(C53-2): C53.2 R55.1 R56.2 U17.7(P1A)
Net-(C55-1): C55.1 U14.1(OUTA) U14.2(-INA)
Net-(C56-1): C56.1 U14.13(-IND) U14.14(OUTD)
Net-(C57-1): C57.1 U14.6(-INB) U14.7(OUTB)
Net-(C58-1): C58.1 U14.8(OUTC) U14.9(-INC)
Net-(C72-1): C72.1 R108.1 U24.2(IN1-)
Net-(C73-1): C73.1 R109.1 U24.6(IN2-)
Net-(C86-1): C86.1 Q5.1(B) R113.1 R114.2
Net-(C86-2): C86.2 R112.2
Net-(C87-2): C87.2 Q5.3(C) R116.1
Net-(C89-2): C89.2 U2.9(RCLK) X2.1
Net-(C90-2): C90.2 U2.17(GPO3/[DCLK]) X2.2(GND)
Net-(D17-1): D17.1 R20.2 U7.1(CS#)
Net-(D18-1): D18.1 R21.2 U7.2(SO)
Net-(D19-1): D19.1 R22.1 U7.6(SCK)
Net-(D20-1): D20.1 R23.1 U7.5(SI)
Net-(J7-1): J7.1 R112.1
Net-(Q5-2): Q5.2(E) R115.2
Net-(R2-2): R2.2 U10.31(RXIN4/ASCKI0)
Net-(R10-2): R10.2 U10.30(RXIN5/ABCKI0)
Net-(R14-2): R14.2 U10.40(XTO)
Net-(R15-2): R15.2 U10.35(RXIN1)
Net-(R16-2): R16.2 U10.37(RXIN0)
Net-(R17-2): R17.2 U10.32(RXIN3)
Net-(R18-2): R18.2 U10.28(RXIN7/ADIN0)
Net-(R19-2): R19.2 U10.29(RXIN6/ALRCKI0)
Net-(R45-1): R45.1 U13.5(P1B) U13.6(P1W)
Net-(R46-1): R46.1 U13.9(P0W) U13.10(P0B)
Net-(R47-1): R47.1 U15.5(P1B) U15.6(P1W)
Net-(R48-1): R48.1 U15.9(P0W) U15.10(P0B)
Net-(R61-2): R61.2 R62.1 R70.2 U19.2(-INA)
Net-(R63-2): R63.2 R64.1 U19.13(-IND)
Net-(R65-1): R65.1 R66.2 U19.9(-INC)
Net-(R67-1): R67.1 R68.2 R69.2 U19.6(-INB)
Net-(R73-2): R73.2 R74.1 U20.6(-INB)
Net-(R75-2): R75.2 R76.1 U20.9(-INC)
Net-(R77-1): R77.1 R78.2 U20.13(-IND)
Net-(R79-1): R79.1 R80.2 U20.2(-INA)
Net-(R84-2): R84.2 U10.33(RXIN2)
Net-(R85-1): R85.1 U22.1(OUTA)
Net-(R86-1): R86.1 U22.7(OUTB)
Net-(R97-1): R97.1 U23.8(RS)
Net-(R104-2): R104.2 R105.2 U25.3(IN-)
Net-(R106-2): R106.2 R107.2 U25.1(IN+)
Net-(R119-2): R119.2 U1.12(PD2)
Net-(R120-1): R120.1 U1.13(PD3)

Not connected (* = marked no-connect by the designer): J6 3*; U1 26(PF6(RESET#))*; U2 1(NC)* 15(DOUT)* 16(DFS)* 20(NC)*; U3 1(NC)* 13(ROUT/[DOUT])* 14(LOUT/[DFS])* 15(DOUT)* 16(DFS)* 20(NC)*; U4 4(CX OR CY)*; U6 7(MFP)*; U7 3(NC)*; U10 2(NPCM/INT1)* 3(MPIO_A0)* 4(MPIO_A1)* 5(MPIO_A2)* 6(MPIO_A3)* 16(MPO1)*; U21 4(CX OR CY)*; U23 5(VREF)*; X1 2(GND)* 4(GND)*

## Notes on the sheets
sheet 1
- PVDD: 3.3V
  DVDD: 3.3V
  AVDD: 5V
  VVDD: 5V, unswitched
sheet 4
- For antenna connector, use RFU-523
sheet 9
- Buffer
- Treble Control
- -A6V
- Bass Control
- Volume/Balance/Fader Control
